# EasyEDA Pro project ProProject_H-Bridge_2024-06-21.epro

# Schematic finalna doska?
Create Date: 2024-05-27; Page Name: P1; Project Name: H-Bridge; Schematic Name: Schematic3; Update Date: 2024-05-27; Company: EasyEDA.com; Drawn: EasyEDA; Page Size: A4; Part Number: JLCPCB-002; Reviewed: EasyEDA; Version: V0.1
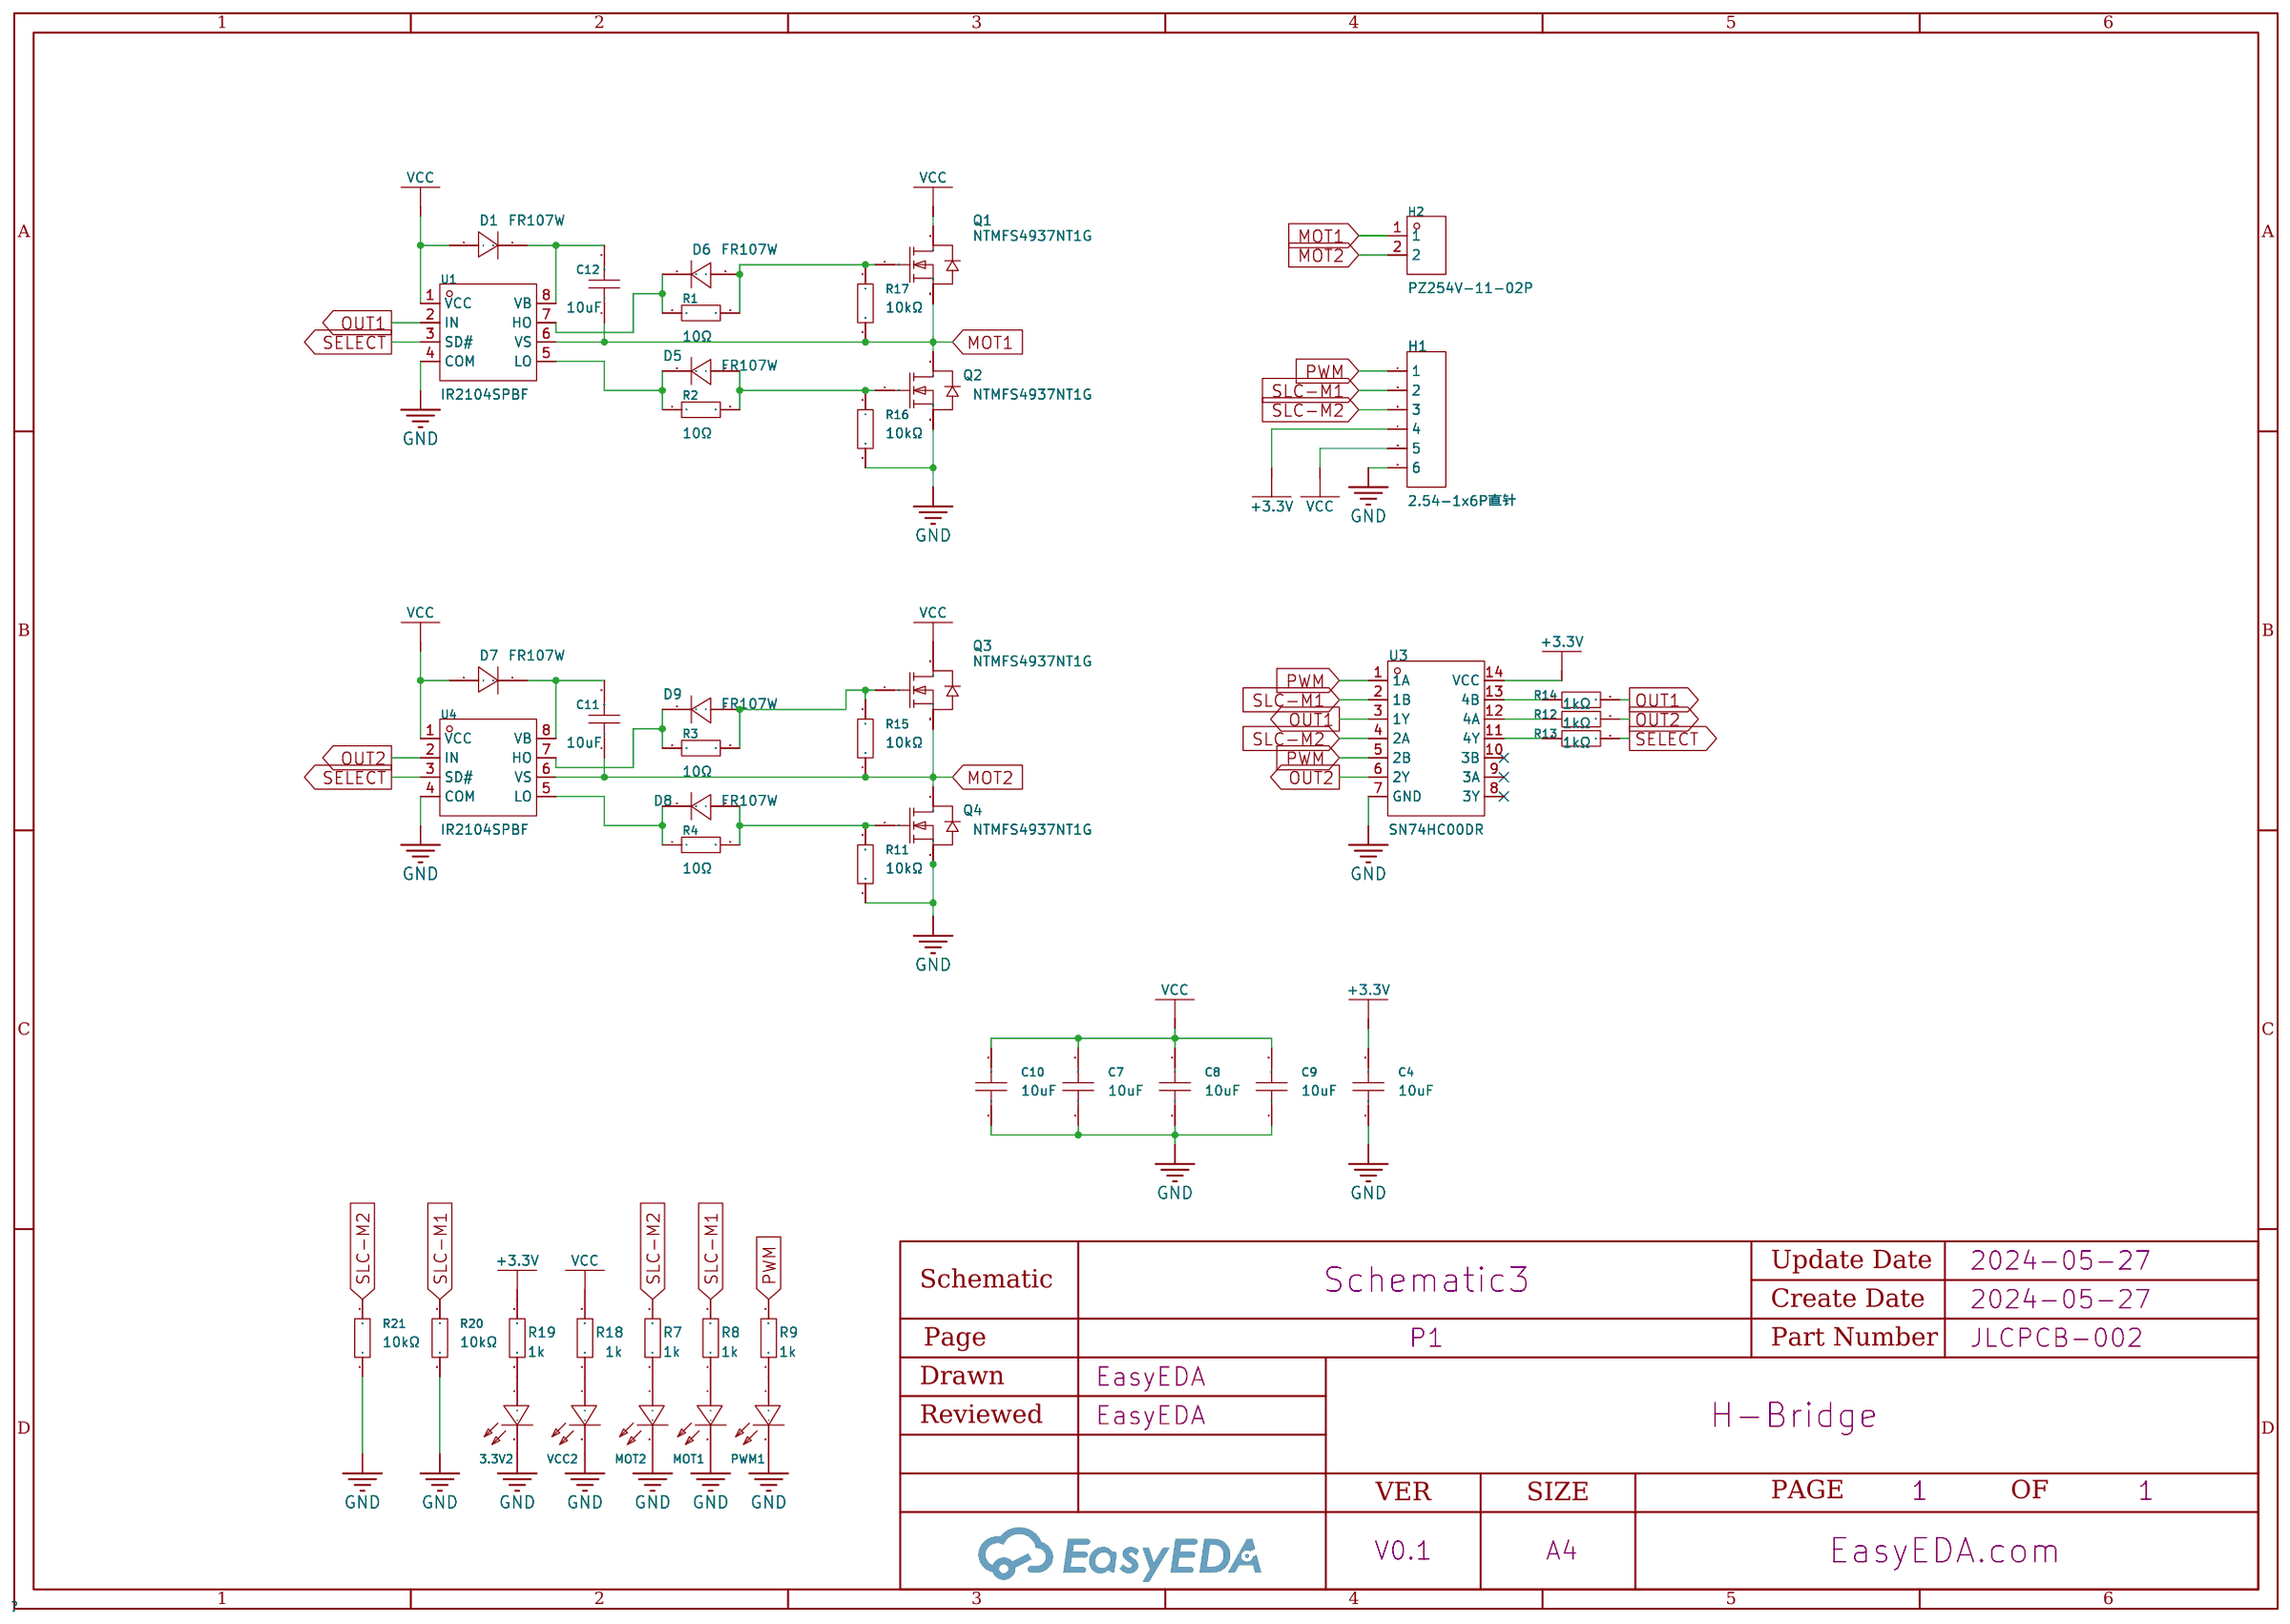
[diagram p0: schematic sheet]

## Parts
3.3V2  NCD0805R1  [LED0805-R-RD]
C4  10uF  [C1206]
C7  10uF  [C1206]
C8  10uF  [C1206]
C9  10uF  [C1206]
C10  10uF  [C1206]
C11  10uF  [C1206]
C12  10uF  [C1206]
D1  FR107W  [SOD-123F_L2.8-W1.8-LS3.7-RD]
D5  FR107W  [SOD-123F_L2.8-W1.8-LS3.7-RD]
D6  FR107W  [SOD-123F_L2.8-W1.8-LS3.7-RD]
D7  FR107W  [SOD-123F_L2.8-W1.8-LS3.7-RD]
D8  FR107W  [SOD-123F_L2.8-W1.8-LS3.7-RD]
D9  FR107W  [SOD-123F_L2.8-W1.8-LS3.7-RD]
H1  2.54-1x6P直针  [HDR-TH_6P-P2.54-V-M-1]
H2  PZ254V-11-02P  [HDR-TH_2P-P2.54-V-M]
MOT1  NCD0805R1  [LED0805-R-RD]
MOT2  NCD0805R1  [LED0805-R-RD]
PWM1  NCD0805R1  [LED0805-R-RD]
Q1  NTMFS4937NT1G  [DFN-5_L6.1-W5.1-P1.27-BL]
Q2  NTMFS4937NT1G  [DFN-5_L6.1-W5.1-P1.27-BL]
Q3  NTMFS4937NT1G  [DFN-5_L6.1-W5.1-P1.27-BL]
Q4  NTMFS4937NT1G  [DFN-5_L6.1-W5.1-P1.27-BL]
R1  10Ω  [R0805]
R2  10Ω  [R0805]
R3  10Ω  [R0805]
R4  10Ω  [R0805]
R7  1k  [R0603]
R8  1k  [R0603]
R9  1k  [R0603]
R11  10kΩ  [R0805]
R12  1kΩ  [R0805]
R13  1kΩ  [R0805]
R14  1kΩ  [R0805]
R15  10kΩ  [R0805]
R16  10kΩ  [R0805]
R17  10kΩ  [R0805]
R18  1k  [R0603]
R19  1k  [R0603]
R20  10kΩ  [R0805]
R21  10kΩ  [R0805]
U1  IR2104SPBF  [SOIC-8_L4.9-W3.9-P1.27-LS6.0-BL]
U3  SN74HC00DR  [SOIC-14_L8.7-W3.9-P1.27-LS6.0-BL]
U4  IR2104SPBF  [SOIC-8_L4.9-W3.9-P1.27-LS6.0-BL]
VCC2  NCD0805R1  [LED0805-R-RD]

## Library data of the parts
3.3V2 MOT1 MOT2 PWM1 VCC2 = Led_SMD_0805: Lamp Holder Type:- Emitted Color:Red Forward Voltage (VF):1.6V~2.6V Forward Voltage (VF):1.6V~2.6V Power Dissipation:65mW Forward Current:20mA Dominant Wavelength:615nm~630nm Dominant Wavelength:615nm~630nm Peak Wavelength:- Diode Configuration:独立二极管 Lens; Supplier Part: C84256; Manufacturer: 国星光电; Supplier Footprint: 0805; JLCPCB Part Class: Basic Part; Datasheet: https://atta.szlcsc.com/upload/public/pdf/source/20200820/C84256_F0A75A43B3EAD75808600A0514C76B99.pdf; Supplier: LCSC; Emitted Color: Red; Forward Voltage (VF): 1.6V~2.6V; Power Dissipation: 65mW; Forward Current: 20mA; Dominant Wavelength: 615nm~630nm; Diode Configuration: 独立二极管; Lens Color: 无色透明; Luminous Intensity: 67mcd~195mcd; Viewing Angle: 130°; Operating Temperature: -30℃~+85℃
C4 C7-C12 = CL31B106KAHNNNE: Capacitance: Tolerance:±10% Tolerance:±10% Voltage Rated: Temperature Coefficient:; LCSC Part Name: 10uF ±10% 25V; Supplier Part: C14860; Manufacturer: SAMSUNG(三星); Supplier Footprint: 1206; JLCPCB Part Class: Extended Part; Datasheet: https://atta.szlcsc.com/upload/public/pdf/source/20160218/1457707763339.pdf; Supplier: LCSC; Tolerance: ±10%
D1 D5-D9 = FR107W_C122857: Diode Configuration: Forward Voltage (Vf@If):1.3V@1A Reverse Voltage (Vr): Average Rectified Current (Io): Reverse Leakage Current:5uA@1kV Reverse Recovery Time (trr): Operating Temperature:-55℃~+150℃@(Tj) Operating Temperature:-55℃~+150℃@(Tj); LCSC Part Name: 电压:1kV 电流:1A; Supplier Part: C122857; Manufacturer: SHIKUES(时科); Supplier Footprint: SOD-123F; JLCPCB Part Class: Extended Part; Datasheet: https://atta.szlcsc.com/upload/public/pdf/source/20180316/F3E7108A5E6E8028984F3C9596186C34.pdf; Supplier: LCSC; Forward Voltage (Vf@If): 1.3V@1A; Reverse Leakage Current: 5uA@1kV; Operating Temperature: -55℃~+150℃@(Tj)
H1 = 2.54-1x6P直针: Pin Structure:1x6P Pitch:2.54mm Row Spacing:- Circluar Pins/Square Pins:Square Pins Mounting Type:Straight Number of Rows:Plugin Number of Pins:6P Current Rating (Max):3A Voltage Rating (Max):- Length of Mating Pin:- Insulation Height:- Contact Material:; LCSC Part Name: 间距:2.54mm 1x6P 直插 方针; Supplier Part: C37208; Manufacturer: BOOMELE(博穆精密); Supplier Footprint: 插件,P=2.54mm; JLCPCB Part Class: Extended Part; Supplier: LCSC; Pin Structure: 1x6P; Pitch: 2.54mm; Circluar Pins/Square Pins: Square Pins; Mounting Type: Straight; Number of Rows: Plugin; Number of Pins: 6P; Current Rating (Max): 3A; Operating Temperature Range: -40℃~+105℃; Color: Black
H2 = PZ254V-11-02P: Pin Structure:1x2P Pitch:2.54mm Row Spacing:- Circluar Pins/Square Pins:Square Pins Mounting Type:Straight Number of Rows:Plugin Number of Pins:2P Current Rating (Max):- Voltage Rating (Max):- Length of Mating Pin:6mm Insulation Height:2.5mm Length of End; LCSC Part Name: 间距:2.54mm 1x2P 直插 方针; Supplier Part: C492401; Manufacturer: XFCN(兴飞); Supplier Footprint: 插件,P=2.54mm; JLCPCB Part Class: Extended Part; Datasheet: https://atta.szlcsc.com/upload/public/pdf/source/20200309/C492401_A812433581A9B211A7FFA413ADDFF0E5.pdf; Supplier: LCSC; Pin Structure: 1x2P; Pitch: 2.54mm; Circluar Pins/Square Pins: Square Pins; Mounting Type: Straight; Number of Rows: Plugin; Number of Pins: 2P; Length of Mating Pin: 6mm; Insulation Height: 2.5mm; Length of End Connection Pin: 3mm; Operating Temperature Range: -40℃~+105℃; Color: Black
Q1-Q4 = NTMFS4937NT1G: Type:1个NChannel Drain Source Voltage (Vdss): Continuous Drain Current (Id):； Power Dissipation (Pd):； Drain Source On Resistance (RDS(on)@Vgs,Id):4mΩ@10V,30A Gate Threshold Voltage (Vgs(th)@Id):2.2V@250uA Total Gate Charge (Qg@Vgs):31nC@10V Input Capacita; LCSC Part Name: 1个N沟道 耐压:30V 电流:10.2A 电流:70A; Supplier Part: C94419; Manufacturer: onsemi(安森美); Supplier Footprint: DFN-5(5x6); JLCPCB Part Class: Extended Part; Datasheet: https://atta.szlcsc.com/upload/public/pdf/source/20170120/1484891320893.PDF; Supplier: LCSC; Type: 1个NChannel; Continuous Drain Current (Id): ；; Power Dissipation (Pd): ；; Drain Source On Resistance (RDS(on)@Vgs,Id): 4mΩ@10V,30A; Gate Threshold Voltage (Vgs(th)@Id): 2.2V@250uA; Total Gate Charge (Qg@Vgs): 31nC@10V; Input Capacitance (Ciss@Vds): 2.516nF@15V; Operating Temperature: -55℃~+150℃@(Tj)
R1-R4 R11-R17 R20 R21 = 0805W8F1002T5E: Type:Thick Film Resistors Resistance:10kΩ Tolerance:±1% Tolerance:±1% Power(Watts): Overload Voltage (Max): Temperature Coefficient:±100ppm/℃ Temperature Coefficient:±100ppm/℃ Operating Temperature Range:-55℃~+155℃ Operating Temperature Range:-55℃~+155℃; LCSC Part Name: 10kΩ ±1% 125mW 厚膜电阻; Supplier Part: C17414; Manufacturer: UNI-ROYAL(厚声); Supplier Footprint: 0805; JLCPCB Part Class: Basic Part; Datasheet: https://atta.szlcsc.com/upload/public/pdf/source/20200306/C422600_1E6D84923E4A46A82E41ADD87F860B5C.pdf; Supplier: LCSC; Type: Thick Film Resistors; Tolerance: ±1%; Temperature Coefficient: ±100ppm/℃; Operating Temperature Range: -55℃~+155℃
R7-R9 R18 R19 = Res_0603: Supplier Footprint: 0603
U1 U4 = IR2104SPBF_C5204801: Supplier Part: C5204801; Manufacturer: Infineon(英飞凌); Supplier Footprint: SOIC-8; JLCPCB Part Class: Extended Part; Datasheet: https://atta.szlcsc.com/upload/public/pdf/source/20200311/C495814_C460DC56A6CDB79957663740A058A097.pdf; Supplier: LCSC
U3 = SN74HC00DR: Logic Gate Type:与Non-门 Number of Channels:4 Supply Voltage:2V~6V Supply Voltage:2V~6V Quiescent Current (Max):2uA Sink Current:5.2mA Source Current:5.2mA High Level Range (VIH):1.5V~4.2V High Level Range (VIH):1.5V~4.2V Low Level Range (VIL):500mV~1.8V Lo; Supplier Part: C10090; Manufacturer: TI(德州仪器); Supplier Footprint: SOIC-14; JLCPCB Part Class: Extended Part; Datasheet: https://www.ti.com/cn/lit/gpn/sn74hc00; Supplier: LCSC; Logic Gate Type: 与Non-门; Number of Channels: 4; Supply Voltage: 2V~6V; Quiescent Current (Max): 2uA; Sink Current: 5.2mA; Source Current: 5.2mA; High Level Range (VIH): 1.5V~4.2V; Low Level Range (VIL): 500mV~1.8V; Series: 74HCSeries; Propagation Delay Time: 15ns@6V,50pF; Operating Temperature: -40℃~+85℃

## Nets
+3.3V: C4.2 H1.4 R19.2 U3.14(VCC)
GND: 3.3V2.2(-) C4.1 C7.1 C8.1 C9.1 C10.1 H1.6 MOT1.2(-) MOT2.2(-) PWM1.2(-) Q2.1(S) Q2.2(S) Q2.3(S) Q4.1(S) Q4.2(S) Q4.3(S) R11.1 R16.2 R20.1 R21.1 U1.4(COM) U3.7(GND) U4.4(COM) VCC2.2(-)
VCC: C7.2 C8.2 C9.2 C10.2 D1.2(A) D7.2(A) H1.5 Q1.5(D) Q3.5(D) R18.2 U1.1(VCC) U4.1(VCC)
MOT1: C12.1 H2.1 Q1.1(S) Q1.2(S) Q1.3(S) Q2.5(D) R17.2 U1.6(VS)
MOT2: C11.1 H2.2 Q3.1(S) Q3.2(S) Q3.3(S) Q4.5(D) R15.1 U4.6(VS)
OUT1: R14.2 U1.2(IN) U3.3(1Y)
OUT2: R12.2 U3.6(2Y) U4.2(IN)
PWM: H1.1 R9.2 U3.1(1A) U3.5(2B)
SELECT: R13.2 U1.3(SD#) U4.3(SD#)
SLC-M1: H1.2 R8.2 R20.2 U3.2(1B)
SLC-M2: H1.3 R7.2 R21.2 U3.4(2A)
Net-(3.3V2-1): 3.3V2.1(+) R19.1
Net-(C11-2): C11.2 D7.1(K) U4.8(VB)
Net-(C12-2): C12.2 D1.1(K) U1.8(VB)
Net-(D5-1): D5.1(K) R2.1 U1.5(LO)
Net-(D5-2): D5.2(A) Q2.4(G) R2.2 R16.1
Net-(D6-1): D6.1(K) R1.1 U1.7(HO)
Net-(D6-2): D6.2(A) Q1.4(G) R1.2 R17.1
Net-(D8-1): D8.1(K) R4.1 U4.5(LO)
Net-(D8-2): D8.2(A) Q4.4(G) R4.2 R11.2
Net-(D9-1): D9.1(K) R3.1 U4.7(HO)
Net-(D9-2): D9.2(A) Q3.4(G) R3.2 R15.2
Net-(MOT1-1): MOT1.1(+) R8.1
Net-(MOT2-1): MOT2.1(+) R7.1
Net-(PWM1-1): PWM1.1(+) R9.1
Net-(R12-1): R12.1 U3.12(4A)
Net-(R13-1): R13.1 U3.11(4Y)
Net-(R14-1): R14.1 U3.13(4B)
Net-(R18-1): R18.1 VCC2.1(+)

Not connected (* = marked no-connect by the designer): U3 8(3Y)* 9(3A)* 10(3B)*

# Schematic Schematic1
Create Date: 2024-04-17; Page Name: P1; Project Name: H-Bridge; Schematic Name: Schematic1; Update Date: 2024-04-25; Company: EasyEDA.com; Drawn: EasyEDA; Page Size: A4; Part Number: JLCPCB-002; Reviewed: EasyEDA; Version: V0.1
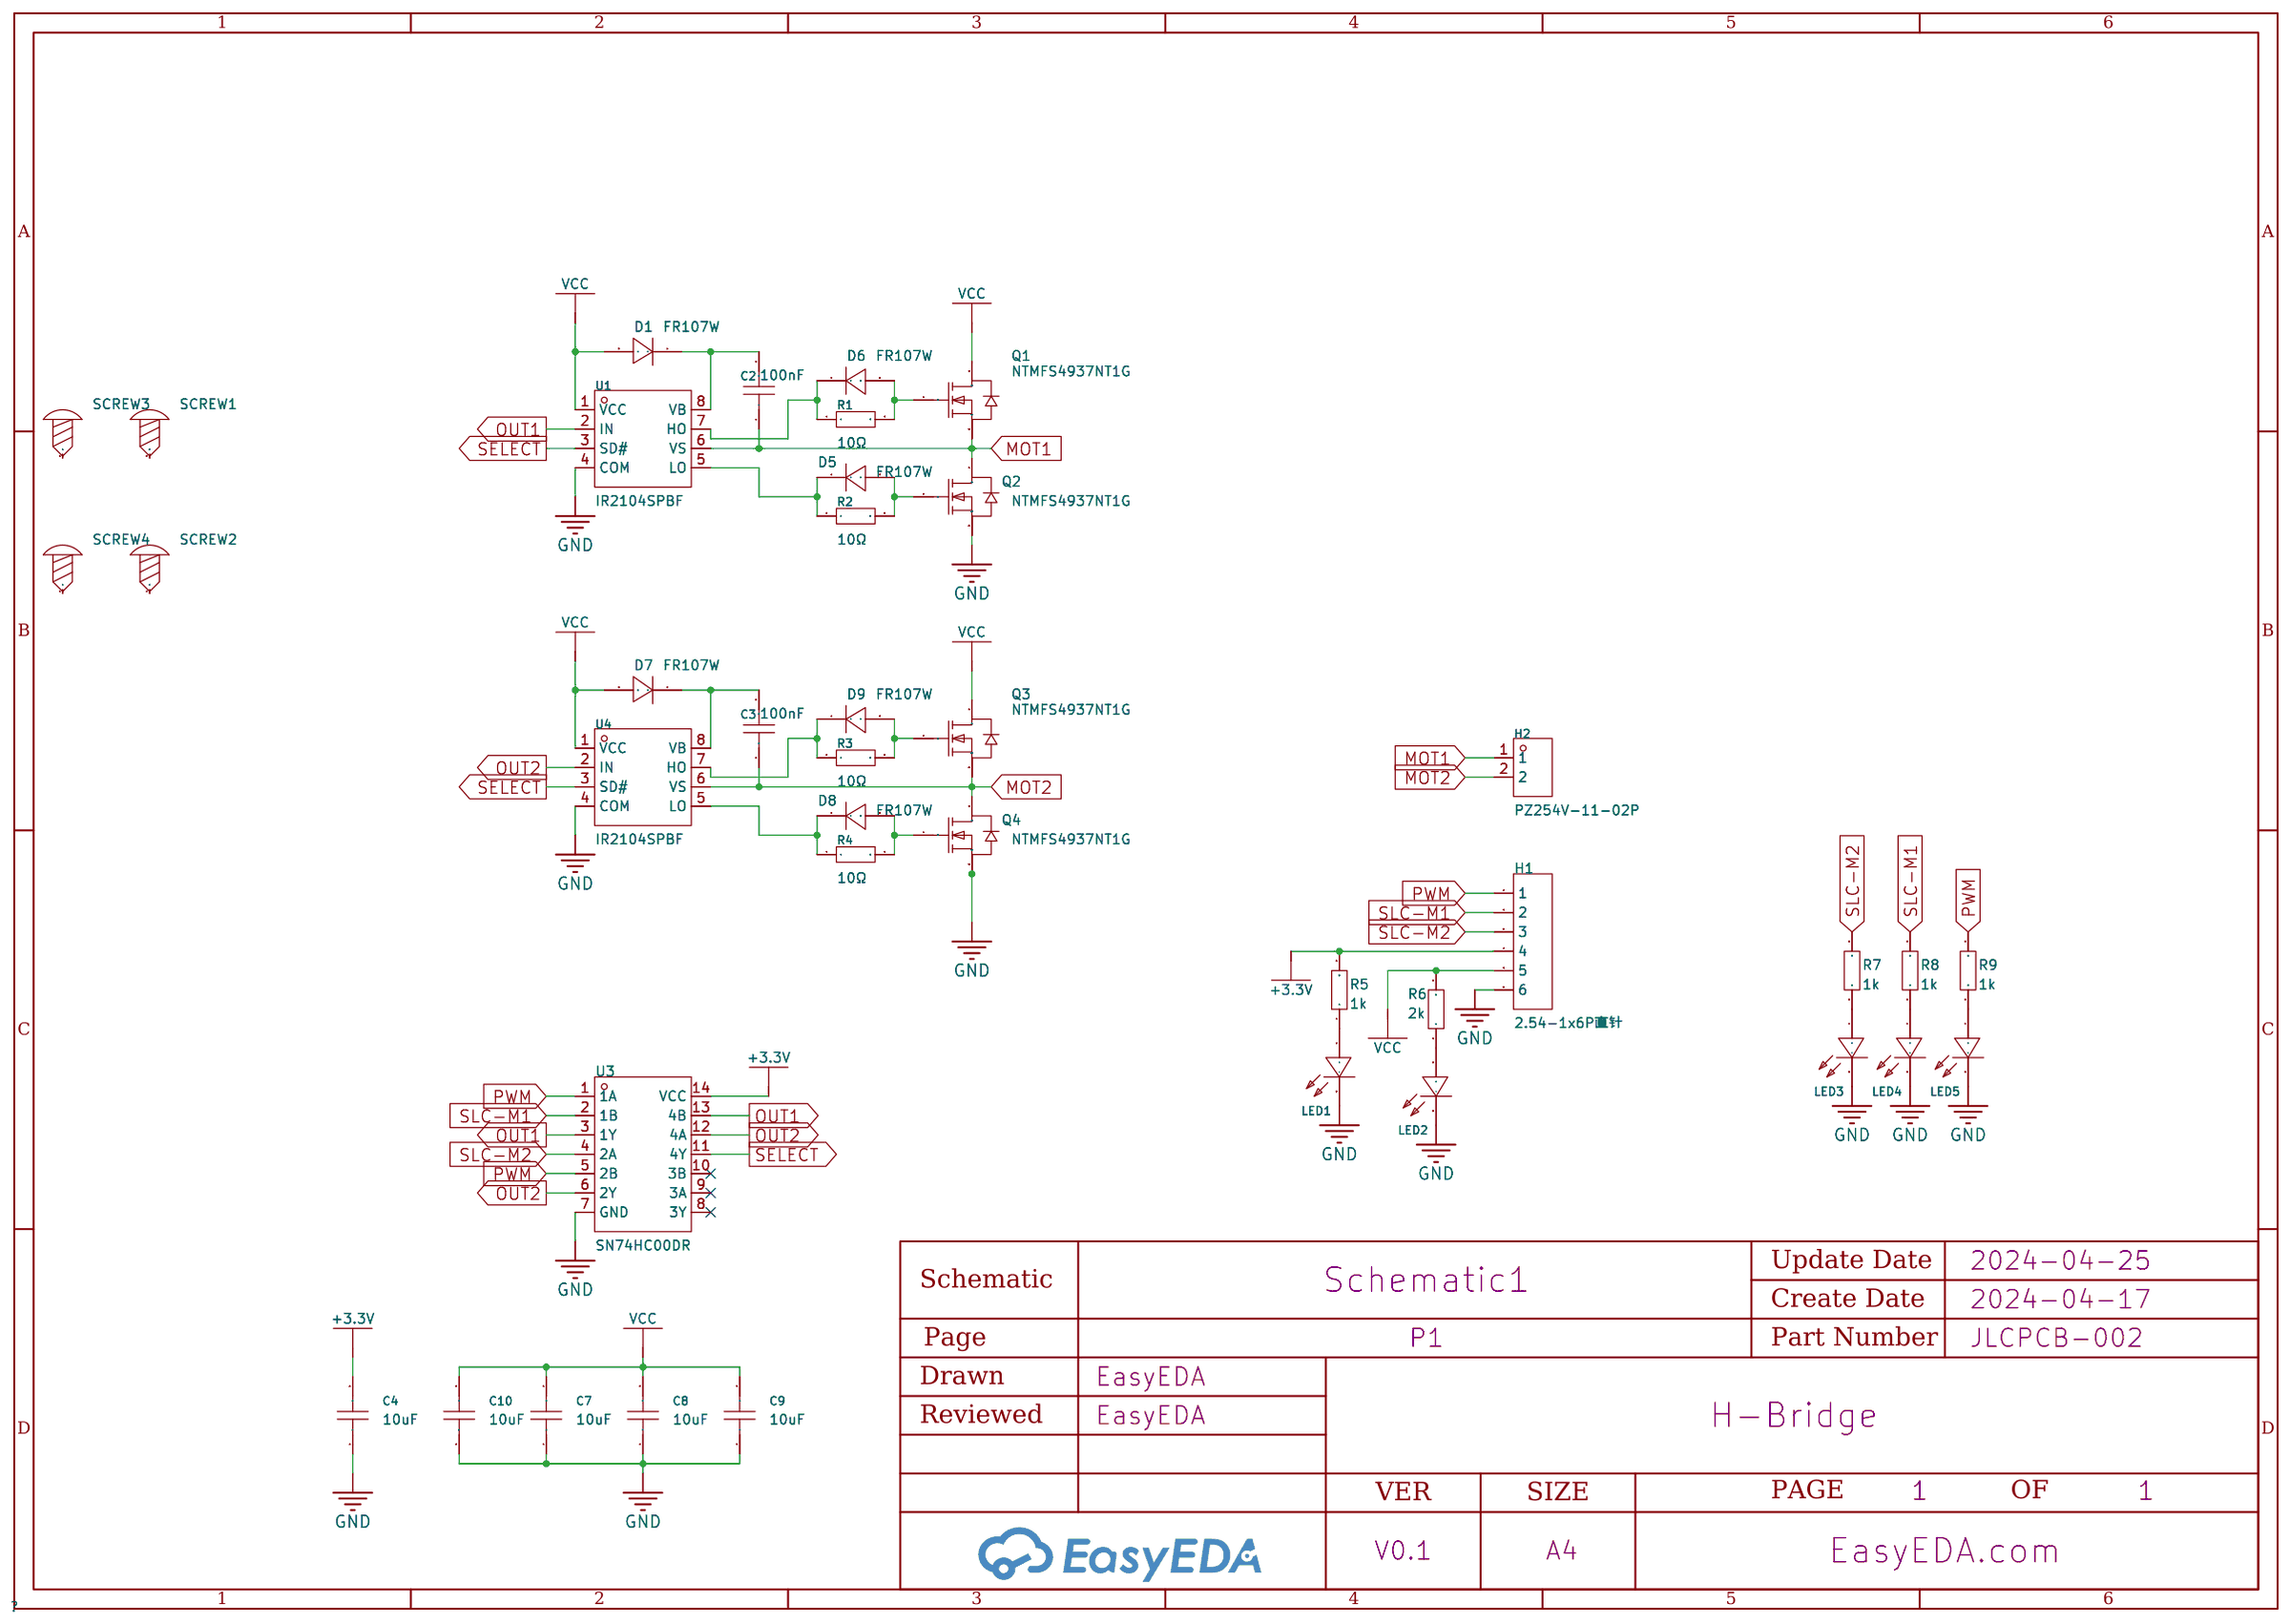
[diagram p1: schematic sheet]

## Parts
C2  100nF  [CAP-TH_L5.0-W2.5-P5.08-D0.7]
C3  100nF  [CAP-TH_L5.0-W2.5-P5.08-D0.7]
C4  10uF  [C1206]
C7  10uF  [C1206]
C8  10uF  [C1206]
C9  10uF  [C1206]
C10  10uF  [C1206]
D1  FR107W  [SOD-123F_L2.8-W1.8-LS3.7-RD]
D5  FR107W  [SOD-123F_L2.8-W1.8-LS3.7-RD]
D6  FR107W  [SOD-123F_L2.8-W1.8-LS3.7-RD]
D7  FR107W  [SOD-123F_L2.8-W1.8-LS3.7-RD]
D8  FR107W  [SOD-123F_L2.8-W1.8-LS3.7-RD]
D9  FR107W  [SOD-123F_L2.8-W1.8-LS3.7-RD]
H1  2.54-1x6P直针  [HDR-TH_6P-P2.54-V-M-1]
H2  PZ254V-11-02P  [HDR-TH_2P-P2.54-V-M]
LED1  NCD0805R1  [LED0805-R-RD]
LED2  NCD0805R1  [LED0805-R-RD]
LED3  NCD0805R1  [LED0805-R-RD]
LED4  NCD0805R1  [LED0805-R-RD]
LED5  NCD0805R1  [LED0805-R-RD]
Q1  NTMFS4937NT1G  [DFN-5_L6.1-W5.1-P1.27-BL]
Q2  NTMFS4937NT1G  [DFN-5_L6.1-W5.1-P1.27-BL]
Q3  NTMFS4937NT1G  [DFN-5_L6.1-W5.1-P1.27-BL]
Q4  NTMFS4937NT1G  [DFN-5_L6.1-W5.1-P1.27-BL]
R1  10Ω  [R0805]
R2  10Ω  [R0805]
R3  10Ω  [R0805]
R4  10Ω  [R0805]
R5  1k  [R0603]
R6  2k  [R0603]
R7  1k  [R0603]
R8  1k  [R0603]
R9  1k  [R0603]
SCREW1  -  [Screw-Hole-M2]
SCREW2  -  [Screw-Hole-M2]
SCREW3  -  [Screw-Hole-M2]
SCREW4  -  [Screw-Hole-M2]
U1  IR2104SPBF  [SOIC-8_L4.9-W3.9-P1.27-LS6.0-BL]
U3  SN74HC00DR  [SOIC-14_L8.7-W3.9-P1.27-LS6.0-BL]
U4  IR2104SPBF  [SOIC-8_L4.9-W3.9-P1.27-LS6.0-BL]

## Library data of the parts
C2 C3 = CC1H104ZC74D3F5O30MN: Capacitance:100nF Tolerance:-20%~+80% Tolerance:-20%~+80% Voltage Rated: Lead Spacing: Temperature Coefficient: φD: Body Thickness:; LCSC Part Name: 100nF -20%~+80% 50V; Supplier Part: C254094; Manufacturer: Dersonic(德尔创); Supplier Footprint: 插件,P=5.08mm; JLCPCB Part Class: Extended Part; Datasheet: https://atta.szlcsc.com/upload/public/pdf/source/20200826/C254094_5CB2628DB82B55380EF0EA1FCCF0C073.pdf; Supplier: LCSC; Tolerance: -20%~+80%
C4 C7-C10 = CL31B106KAHNNNE: Capacitance: Tolerance:±10% Tolerance:±10% Voltage Rated: Temperature Coefficient:; LCSC Part Name: 10uF ±10% 25V; Supplier Part: C14860; Manufacturer: SAMSUNG(三星); Supplier Footprint: 1206; JLCPCB Part Class: Extended Part; Datasheet: https://atta.szlcsc.com/upload/public/pdf/source/20160218/1457707763339.pdf; Supplier: LCSC; Tolerance: ±10%
D1 D5-D9 = FR107W_C122857: Diode Configuration: Forward Voltage (Vf@If):1.3V@1A Reverse Voltage (Vr): Average Rectified Current (Io): Reverse Leakage Current:5uA@1kV Reverse Recovery Time (trr): Operating Temperature:-55℃~+150℃@(Tj) Operating Temperature:-55℃~+150℃@(Tj); LCSC Part Name: 电压:1kV 电流:1A; Supplier Part: C122857; Manufacturer: SHIKUES(时科); Supplier Footprint: SOD-123F; JLCPCB Part Class: Extended Part; Datasheet: https://atta.szlcsc.com/upload/public/pdf/source/20180316/F3E7108A5E6E8028984F3C9596186C34.pdf; Supplier: LCSC; Forward Voltage (Vf@If): 1.3V@1A; Reverse Leakage Current: 5uA@1kV; Operating Temperature: -55℃~+150℃@(Tj)
H1 = 2.54-1x6P直针: Pin Structure:1x6P Pitch:2.54mm Row Spacing:- Circluar Pins/Square Pins:Square Pins Mounting Type:Straight Number of Rows:Plugin Number of Pins:6P Current Rating (Max):3A Voltage Rating (Max):- Length of Mating Pin:- Insulation Height:- Contact Material:; LCSC Part Name: 间距:2.54mm 1x6P 直插 方针; Supplier Part: C37208; Manufacturer: BOOMELE(博穆精密); Supplier Footprint: 插件,P=2.54mm; JLCPCB Part Class: Extended Part; Supplier: LCSC; Pin Structure: 1x6P; Pitch: 2.54mm; Circluar Pins/Square Pins: Square Pins; Mounting Type: Straight; Number of Rows: Plugin; Number of Pins: 6P; Current Rating (Max): 3A; Operating Temperature Range: -40℃~+105℃; Color: Black
H2 = PZ254V-11-02P: Pin Structure:1x2P Pitch:2.54mm Row Spacing:- Circluar Pins/Square Pins:Square Pins Mounting Type:Straight Number of Rows:Plugin Number of Pins:2P Current Rating (Max):- Voltage Rating (Max):- Length of Mating Pin:6mm Insulation Height:2.5mm Length of End; LCSC Part Name: 间距:2.54mm 1x2P 直插 方针; Supplier Part: C492401; Manufacturer: XFCN(兴飞); Supplier Footprint: 插件,P=2.54mm; JLCPCB Part Class: Extended Part; Datasheet: https://atta.szlcsc.com/upload/public/pdf/source/20200309/C492401_A812433581A9B211A7FFA413ADDFF0E5.pdf; Supplier: LCSC; Pin Structure: 1x2P; Pitch: 2.54mm; Circluar Pins/Square Pins: Square Pins; Mounting Type: Straight; Number of Rows: Plugin; Number of Pins: 2P; Length of Mating Pin: 6mm; Insulation Height: 2.5mm; Length of End Connection Pin: 3mm; Operating Temperature Range: -40℃~+105℃; Color: Black
LED1-LED5 = Led_SMD_0805: Lamp Holder Type:- Emitted Color:Red Forward Voltage (VF):1.6V~2.6V Forward Voltage (VF):1.6V~2.6V Power Dissipation:65mW Forward Current:20mA Dominant Wavelength:615nm~630nm Dominant Wavelength:615nm~630nm Peak Wavelength:- Diode Configuration:独立二极管 Lens; Supplier Part: C84256; Manufacturer: 国星光电; Supplier Footprint: 0805; JLCPCB Part Class: Basic Part; Datasheet: https://atta.szlcsc.com/upload/public/pdf/source/20200820/C84256_F0A75A43B3EAD75808600A0514C76B99.pdf; Supplier: LCSC; Emitted Color: Red; Forward Voltage (VF): 1.6V~2.6V; Power Dissipation: 65mW; Forward Current: 20mA; Dominant Wavelength: 615nm~630nm; Diode Configuration: 独立二极管; Lens Color: 无色透明; Luminous Intensity: 67mcd~195mcd; Viewing Angle: 130°; Operating Temperature: -30℃~+85℃
Q1-Q4 = NTMFS4937NT1G: Type:1个NChannel Drain Source Voltage (Vdss): Continuous Drain Current (Id):； Power Dissipation (Pd):； Drain Source On Resistance (RDS(on)@Vgs,Id):4mΩ@10V,30A Gate Threshold Voltage (Vgs(th)@Id):2.2V@250uA Total Gate Charge (Qg@Vgs):31nC@10V Input Capacita; LCSC Part Name: 1个N沟道 耐压:30V 电流:10.2A 电流:70A; Supplier Part: C94419; Manufacturer: onsemi(安森美); Supplier Footprint: DFN-5(5x6); JLCPCB Part Class: Extended Part; Datasheet: https://atta.szlcsc.com/upload/public/pdf/source/20170120/1484891320893.PDF; Supplier: LCSC; Type: 1个NChannel; Continuous Drain Current (Id): ；; Power Dissipation (Pd): ；; Drain Source On Resistance (RDS(on)@Vgs,Id): 4mΩ@10V,30A; Gate Threshold Voltage (Vgs(th)@Id): 2.2V@250uA; Total Gate Charge (Qg@Vgs): 31nC@10V; Input Capacitance (Ciss@Vds): 2.516nF@15V; Operating Temperature: -55℃~+150℃@(Tj)
R1-R4 = 0805W8F1002T5E: Type:Thick Film Resistors Resistance:10kΩ Tolerance:±1% Tolerance:±1% Power(Watts): Overload Voltage (Max): Temperature Coefficient:±100ppm/℃ Temperature Coefficient:±100ppm/℃ Operating Temperature Range:-55℃~+155℃ Operating Temperature Range:-55℃~+155℃; LCSC Part Name: 10kΩ ±1% 125mW 厚膜电阻; Supplier Part: C17414; Manufacturer: UNI-ROYAL(厚声); Supplier Footprint: 0805; JLCPCB Part Class: Basic Part; Datasheet: https://atta.szlcsc.com/upload/public/pdf/source/20200306/C422600_1E6D84923E4A46A82E41ADD87F860B5C.pdf; Supplier: LCSC; Type: Thick Film Resistors; Tolerance: ±1%; Temperature Coefficient: ±100ppm/℃; Operating Temperature Range: -55℃~+155℃
R5-R9 = Res_0603: Supplier Footprint: 0603
SCREW1-SCREW4 = Screw-Hole-M2: Supplier Footprint: 插件
U1 U4 = IR2104SPBF_C5204801: Supplier Part: C5204801; Manufacturer: Infineon(英飞凌); Supplier Footprint: SOIC-8; JLCPCB Part Class: Extended Part; Datasheet: https://atta.szlcsc.com/upload/public/pdf/source/20200311/C495814_C460DC56A6CDB79957663740A058A097.pdf; Supplier: LCSC
U3 = SN74HC00DR: Logic Gate Type:与Non-门 Number of Channels:4 Supply Voltage:2V~6V Supply Voltage:2V~6V Quiescent Current (Max):2uA Sink Current:5.2mA Source Current:5.2mA High Level Range (VIH):1.5V~4.2V High Level Range (VIH):1.5V~4.2V Low Level Range (VIL):500mV~1.8V Lo; Supplier Part: C10090; Manufacturer: TI(德州仪器); Supplier Footprint: SOIC-14; JLCPCB Part Class: Extended Part; Datasheet: https://www.ti.com/cn/lit/gpn/sn74hc00; Supplier: LCSC; Logic Gate Type: 与Non-门; Number of Channels: 4; Supply Voltage: 2V~6V; Quiescent Current (Max): 2uA; Sink Current: 5.2mA; Source Current: 5.2mA; High Level Range (VIH): 1.5V~4.2V; Low Level Range (VIL): 500mV~1.8V; Series: 74HCSeries; Propagation Delay Time: 15ns@6V,50pF; Operating Temperature: -40℃~+85℃

## Nets
+3.3V: C4.2 H1.4 R5.2 U3.14(VCC)
GND: C4.1 C7.1 C8.1 C9.1 C10.1 H1.6 LED1.2(-) LED2.2(-) LED3.2(-) LED4.2(-) LED5.2(-) Q2.1(S) Q2.2(S) Q2.3(S) Q4.1(S) Q4.2(S) Q4.3(S) U1.4(COM) U3.7(GND) U4.4(COM)
VCC: C7.2 C8.2 C9.2 C10.2 D1.2(A) D7.2(A) H1.5 Q1.5(D) Q3.5(D) R6.2 U1.1(VCC) U4.1(VCC)
MOT1: C2.1 H2.1 Q1.1(S) Q1.2(S) Q1.3(S) Q2.5(D) U1.6(VS)
MOT2: C3.1 H2.2 Q3.1(S) Q3.2(S) Q3.3(S) Q4.5(D) U4.6(VS)
OUT1: U1.2(IN) U3.3(1Y) U3.13(4B)
OUT2: U3.6(2Y) U3.12(4A) U4.2(IN)
PWM: H1.1 R9.2 U3.1(1A) U3.5(2B)
SELECT: U1.3(SD#) U3.11(4Y) U4.3(SD#)
SLC-M1: H1.2 R8.2 U3.2(1B)
SLC-M2: H1.3 R7.2 U3.4(2A)
$1N2563: D5.2(A) Q2.4(G) R2.2
$1N2573: D6.2(A) Q1.4(G) R1.2
$1N2580: C2.2 D1.1(K) U1.8(VB)
$1N2605: D5.1(K) R2.1 U1.5(LO)
$1N2712: D6.1(K) R1.1 U1.7(HO)
$1N3149: D8.2(A) Q4.4(G) R4.2
$1N3153: D9.2(A) Q3.4(G) R3.2
$1N3157: C3.2 D7.1(K) U4.8(VB)
$1N3161: D8.1(K) R4.1 U4.5(LO)
$1N3174: D9.1(K) R3.1 U4.7(HO)
$1N6041: LED1.1(+) R5.1
$1N6069: LED2.1(+) R6.1
$1N6194: LED3.1(+) R7.1
$1N6279: LED4.1(+) R8.1
$1N6364: LED5.1(+) R9.1

Not connected (* = marked no-connect by the designer): SCREW1 1; SCREW2 1; SCREW3 1; SCREW4 1; U3 8(3Y)* 9(3A)* 10(3B)*

# Schematic Schematic2
Create Date: 2024-04-25; Page Name: P1; Project Name: H-Bridge; Schematic Name: Schematic2; Update Date: 2024-04-25; Company: EasyEDA.com; Drawn: EasyEDA; Page Size: A4; Part Number: JLCPCB-002; Reviewed: EasyEDA; Version: V0.1
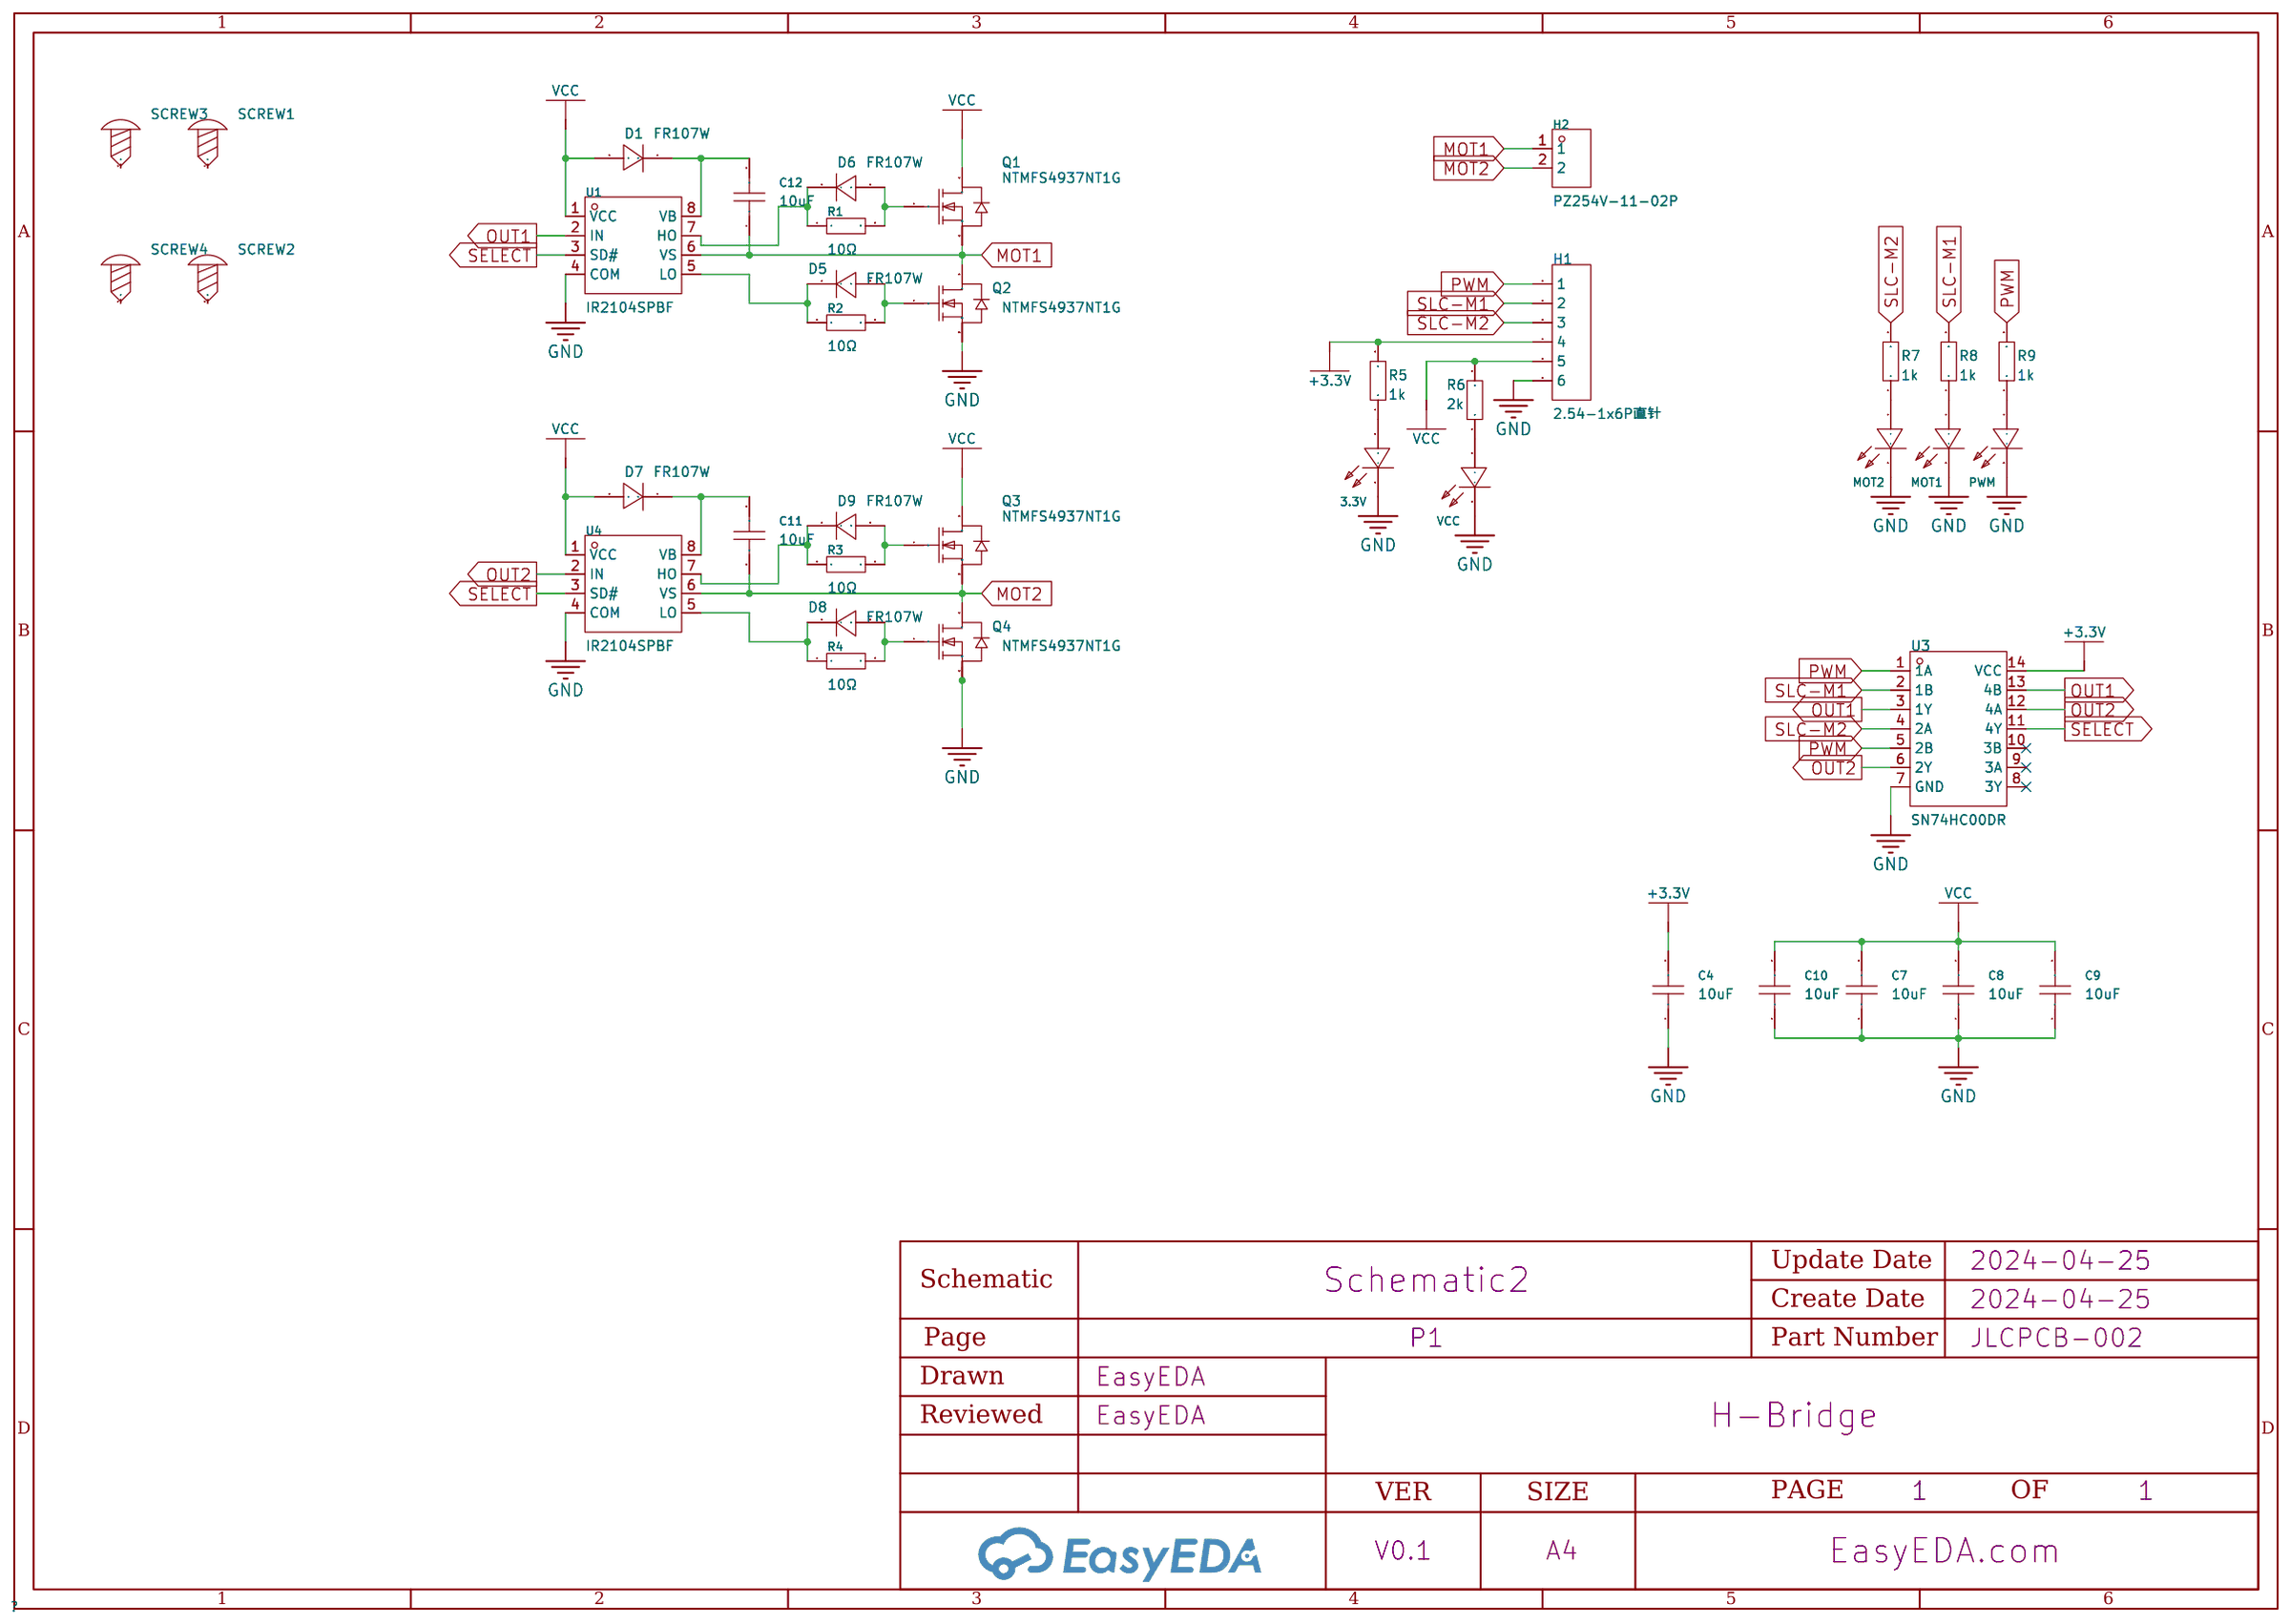
[diagram p2: schematic sheet]

## Parts
3.3V  NCD0805R1  [LED0805-R-RD]
C4  10uF  [C1206]
C7  10uF  [C1206]
C8  10uF  [C1206]
C9  10uF  [C1206]
C10  10uF  [C1206]
C11  10uF  [C1206]
C12  10uF  [C1206]
D1  FR107W  [SOD-123F_L2.8-W1.8-LS3.7-RD]
D5  FR107W  [SOD-123F_L2.8-W1.8-LS3.7-RD]
D6  FR107W  [SOD-123F_L2.8-W1.8-LS3.7-RD]
D7  FR107W  [SOD-123F_L2.8-W1.8-LS3.7-RD]
D8  FR107W  [SOD-123F_L2.8-W1.8-LS3.7-RD]
D9  FR107W  [SOD-123F_L2.8-W1.8-LS3.7-RD]
H1  2.54-1x6P直针  [HDR-TH_6P-P2.54-V-M-1]
H2  PZ254V-11-02P  [HDR-TH_2P-P2.54-V-M]
MOT1  NCD0805R1  [LED0805-R-RD]
MOT2  NCD0805R1  [LED0805-R-RD]
PWM  NCD0805R1  [LED0805-R-RD]
Q1  NTMFS4937NT1G  [DFN-5_L6.1-W5.1-P1.27-BL]
Q2  NTMFS4937NT1G  [DFN-5_L6.1-W5.1-P1.27-BL]
Q3  NTMFS4937NT1G  [DFN-5_L6.1-W5.1-P1.27-BL]
Q4  NTMFS4937NT1G  [DFN-5_L6.1-W5.1-P1.27-BL]
R1  10Ω  [R0805]
R2  10Ω  [R0805]
R3  10Ω  [R0805]
R4  10Ω  [R0805]
R5  1k  [R0603]
R6  2k  [R0603]
R7  1k  [R0603]
R8  1k  [R0603]
R9  1k  [R0603]
SCREW1  -  [Screw-Hole-M2]
SCREW2  -  [Screw-Hole-M2]
SCREW3  -  [Screw-Hole-M2]
SCREW4  -  [Screw-Hole-M2]
U1  IR2104SPBF  [SOIC-8_L4.9-W3.9-P1.27-LS6.0-BL]
U3  SN74HC00DR  [SOIC-14_L8.7-W3.9-P1.27-LS6.0-BL]
U4  IR2104SPBF  [SOIC-8_L4.9-W3.9-P1.27-LS6.0-BL]
VCC  NCD0805R1  [LED0805-R-RD]

## Library data of the parts
3.3V MOT1 MOT2 PWM VCC = Led_SMD_0805: Lamp Holder Type:- Emitted Color:Red Forward Voltage (VF):1.6V~2.6V Forward Voltage (VF):1.6V~2.6V Power Dissipation:65mW Forward Current:20mA Dominant Wavelength:615nm~630nm Dominant Wavelength:615nm~630nm Peak Wavelength:- Diode Configuration:独立二极管 Lens; Supplier Part: C84256; Manufacturer: 国星光电; Supplier Footprint: 0805; JLCPCB Part Class: Basic Part; Datasheet: https://atta.szlcsc.com/upload/public/pdf/source/20200820/C84256_F0A75A43B3EAD75808600A0514C76B99.pdf; Supplier: LCSC; Emitted Color: Red; Forward Voltage (VF): 1.6V~2.6V; Power Dissipation: 65mW; Forward Current: 20mA; Dominant Wavelength: 615nm~630nm; Diode Configuration: 独立二极管; Lens Color: 无色透明; Luminous Intensity: 67mcd~195mcd; Viewing Angle: 130°; Operating Temperature: -30℃~+85℃
C4 C7-C12 = CL31B106KAHNNNE: Capacitance: Tolerance:±10% Tolerance:±10% Voltage Rated: Temperature Coefficient:; LCSC Part Name: 10uF ±10% 25V; Supplier Part: C14860; Manufacturer: SAMSUNG(三星); Supplier Footprint: 1206; JLCPCB Part Class: Extended Part; Datasheet: https://atta.szlcsc.com/upload/public/pdf/source/20160218/1457707763339.pdf; Supplier: LCSC; Tolerance: ±10%
D1 D5-D9 = FR107W_C122857: Diode Configuration: Forward Voltage (Vf@If):1.3V@1A Reverse Voltage (Vr): Average Rectified Current (Io): Reverse Leakage Current:5uA@1kV Reverse Recovery Time (trr): Operating Temperature:-55℃~+150℃@(Tj) Operating Temperature:-55℃~+150℃@(Tj); LCSC Part Name: 电压:1kV 电流:1A; Supplier Part: C122857; Manufacturer: SHIKUES(时科); Supplier Footprint: SOD-123F; JLCPCB Part Class: Extended Part; Datasheet: https://atta.szlcsc.com/upload/public/pdf/source/20180316/F3E7108A5E6E8028984F3C9596186C34.pdf; Supplier: LCSC; Forward Voltage (Vf@If): 1.3V@1A; Reverse Leakage Current: 5uA@1kV; Operating Temperature: -55℃~+150℃@(Tj)
H1 = 2.54-1x6P直针: Pin Structure:1x6P Pitch:2.54mm Row Spacing:- Circluar Pins/Square Pins:Square Pins Mounting Type:Straight Number of Rows:Plugin Number of Pins:6P Current Rating (Max):3A Voltage Rating (Max):- Length of Mating Pin:- Insulation Height:- Contact Material:; LCSC Part Name: 间距:2.54mm 1x6P 直插 方针; Supplier Part: C37208; Manufacturer: BOOMELE(博穆精密); Supplier Footprint: 插件,P=2.54mm; JLCPCB Part Class: Extended Part; Supplier: LCSC; Pin Structure: 1x6P; Pitch: 2.54mm; Circluar Pins/Square Pins: Square Pins; Mounting Type: Straight; Number of Rows: Plugin; Number of Pins: 6P; Current Rating (Max): 3A; Operating Temperature Range: -40℃~+105℃; Color: Black
H2 = PZ254V-11-02P: Pin Structure:1x2P Pitch:2.54mm Row Spacing:- Circluar Pins/Square Pins:Square Pins Mounting Type:Straight Number of Rows:Plugin Number of Pins:2P Current Rating (Max):- Voltage Rating (Max):- Length of Mating Pin:6mm Insulation Height:2.5mm Length of End; LCSC Part Name: 间距:2.54mm 1x2P 直插 方针; Supplier Part: C492401; Manufacturer: XFCN(兴飞); Supplier Footprint: 插件,P=2.54mm; JLCPCB Part Class: Extended Part; Datasheet: https://atta.szlcsc.com/upload/public/pdf/source/20200309/C492401_A812433581A9B211A7FFA413ADDFF0E5.pdf; Supplier: LCSC; Pin Structure: 1x2P; Pitch: 2.54mm; Circluar Pins/Square Pins: Square Pins; Mounting Type: Straight; Number of Rows: Plugin; Number of Pins: 2P; Length of Mating Pin: 6mm; Insulation Height: 2.5mm; Length of End Connection Pin: 3mm; Operating Temperature Range: -40℃~+105℃; Color: Black
Q1-Q4 = NTMFS4937NT1G: Type:1个NChannel Drain Source Voltage (Vdss): Continuous Drain Current (Id):； Power Dissipation (Pd):； Drain Source On Resistance (RDS(on)@Vgs,Id):4mΩ@10V,30A Gate Threshold Voltage (Vgs(th)@Id):2.2V@250uA Total Gate Charge (Qg@Vgs):31nC@10V Input Capacita; LCSC Part Name: 1个N沟道 耐压:30V 电流:10.2A 电流:70A; Supplier Part: C94419; Manufacturer: onsemi(安森美); Supplier Footprint: DFN-5(5x6); JLCPCB Part Class: Extended Part; Datasheet: https://atta.szlcsc.com/upload/public/pdf/source/20170120/1484891320893.PDF; Supplier: LCSC; Type: 1个NChannel; Continuous Drain Current (Id): ；; Power Dissipation (Pd): ；; Drain Source On Resistance (RDS(on)@Vgs,Id): 4mΩ@10V,30A; Gate Threshold Voltage (Vgs(th)@Id): 2.2V@250uA; Total Gate Charge (Qg@Vgs): 31nC@10V; Input Capacitance (Ciss@Vds): 2.516nF@15V; Operating Temperature: -55℃~+150℃@(Tj)
R1-R4 = 0805W8F1002T5E: Type:Thick Film Resistors Resistance:10kΩ Tolerance:±1% Tolerance:±1% Power(Watts): Overload Voltage (Max): Temperature Coefficient:±100ppm/℃ Temperature Coefficient:±100ppm/℃ Operating Temperature Range:-55℃~+155℃ Operating Temperature Range:-55℃~+155℃; LCSC Part Name: 10kΩ ±1% 125mW 厚膜电阻; Supplier Part: C17414; Manufacturer: UNI-ROYAL(厚声); Supplier Footprint: 0805; JLCPCB Part Class: Basic Part; Datasheet: https://atta.szlcsc.com/upload/public/pdf/source/20200306/C422600_1E6D84923E4A46A82E41ADD87F860B5C.pdf; Supplier: LCSC; Type: Thick Film Resistors; Tolerance: ±1%; Temperature Coefficient: ±100ppm/℃; Operating Temperature Range: -55℃~+155℃
R5-R9 = Res_0603: Supplier Footprint: 0603
SCREW1-SCREW4 = Screw-Hole-M2: Supplier Footprint: 插件
U1 U4 = IR2104SPBF_C5204801: Supplier Part: C5204801; Manufacturer: Infineon(英飞凌); Supplier Footprint: SOIC-8; JLCPCB Part Class: Extended Part; Datasheet: https://atta.szlcsc.com/upload/public/pdf/source/20200311/C495814_C460DC56A6CDB79957663740A058A097.pdf; Supplier: LCSC
U3 = SN74HC00DR: Logic Gate Type:与Non-门 Number of Channels:4 Supply Voltage:2V~6V Supply Voltage:2V~6V Quiescent Current (Max):2uA Sink Current:5.2mA Source Current:5.2mA High Level Range (VIH):1.5V~4.2V High Level Range (VIH):1.5V~4.2V Low Level Range (VIL):500mV~1.8V Lo; Supplier Part: C10090; Manufacturer: TI(德州仪器); Supplier Footprint: SOIC-14; JLCPCB Part Class: Extended Part; Datasheet: https://www.ti.com/cn/lit/gpn/sn74hc00; Supplier: LCSC; Logic Gate Type: 与Non-门; Number of Channels: 4; Supply Voltage: 2V~6V; Quiescent Current (Max): 2uA; Sink Current: 5.2mA; Source Current: 5.2mA; High Level Range (VIH): 1.5V~4.2V; Low Level Range (VIL): 500mV~1.8V; Series: 74HCSeries; Propagation Delay Time: 15ns@6V,50pF; Operating Temperature: -40℃~+85℃

## Nets
+3.3V: C4.2 H1.4 R5.2 U3.14(VCC)
GND: 3.3V.2(-) C4.1 C7.1 C8.1 C9.1 C10.1 H1.6 MOT1.2(-) MOT2.2(-) PWM.2(-) Q2.1(S) Q2.2(S) Q2.3(S) Q4.1(S) Q4.2(S) Q4.3(S) U1.4(COM) U3.7(GND) U4.4(COM) VCC.2(-)
VCC: C7.2 C8.2 C9.2 C10.2 D1.2(A) D7.2(A) H1.5 Q1.5(D) Q3.5(D) R6.2 U1.1(VCC) U4.1(VCC)
MOT1: C12.1 H2.1 Q1.1(S) Q1.2(S) Q1.3(S) Q2.5(D) U1.6(VS)
MOT2: C11.1 H2.2 Q3.1(S) Q3.2(S) Q3.3(S) Q4.5(D) U4.6(VS)
OUT1: U1.2(IN) U3.3(1Y) U3.13(4B)
OUT2: U3.6(2Y) U3.12(4A) U4.2(IN)
PWM: H1.1 R9.2 U3.1(1A) U3.5(2B)
SELECT: U1.3(SD#) U3.11(4Y) U4.3(SD#)
SLC-M1: H1.2 R8.2 U3.2(1B)
SLC-M2: H1.3 R7.2 U3.4(2A)
$1N961: D5.2(A) Q2.4(G) R2.2
$1N962: D6.2(A) Q1.4(G) R1.2
$1N963: C12.2 D1.1(K) U1.8(VB)
$1N964: D5.1(K) R2.1 U1.5(LO)
$1N966: D6.1(K) R1.1 U1.7(HO)
$1N973: D8.2(A) Q4.4(G) R4.2
$1N974: D9.2(A) Q3.4(G) R3.2
$1N975: C11.2 D7.1(K) U4.8(VB)
$1N976: D8.1(K) R4.1 U4.5(LO)
$1N978: D9.1(K) R3.1 U4.7(HO)
$1N1617: 3.3V.1(+) R5.1
$1N1618: R6.1 VCC.1(+)
$1N1619: MOT2.1(+) R7.1
$1N1622: MOT1.1(+) R8.1
$1N1625: PWM.1(+) R9.1

Not connected (* = marked no-connect by the designer): SCREW1 1; SCREW2 1; SCREW3 1; SCREW4 1; U3 8(3Y)* 9(3A)* 10(3B)*

# Board PCB1
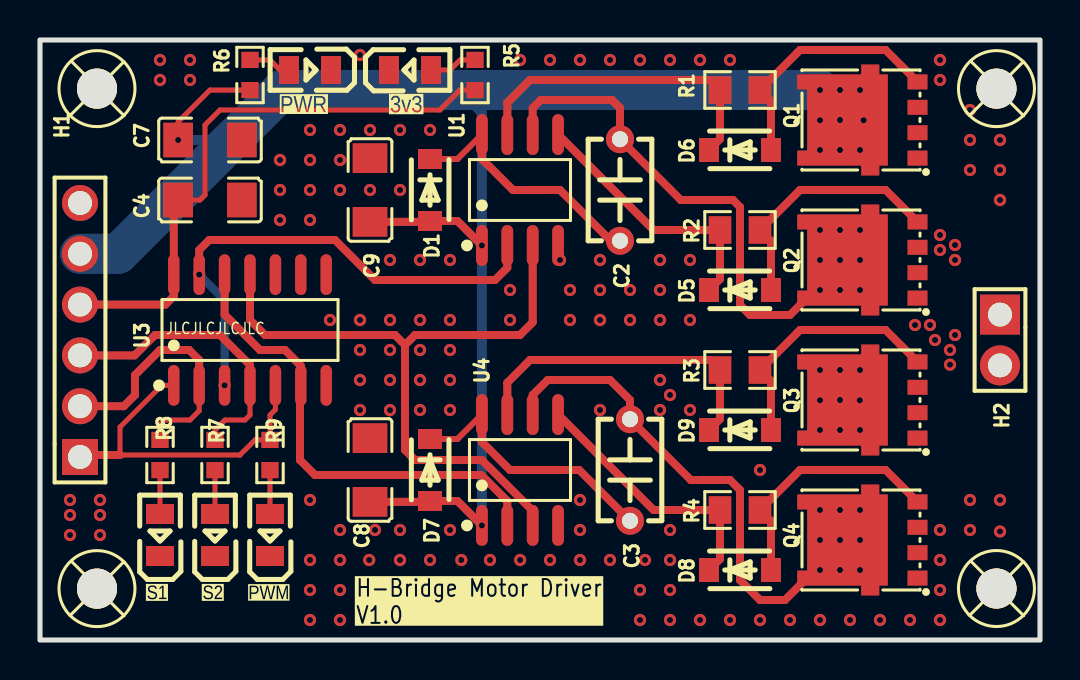
[diagram p3: board, top side]
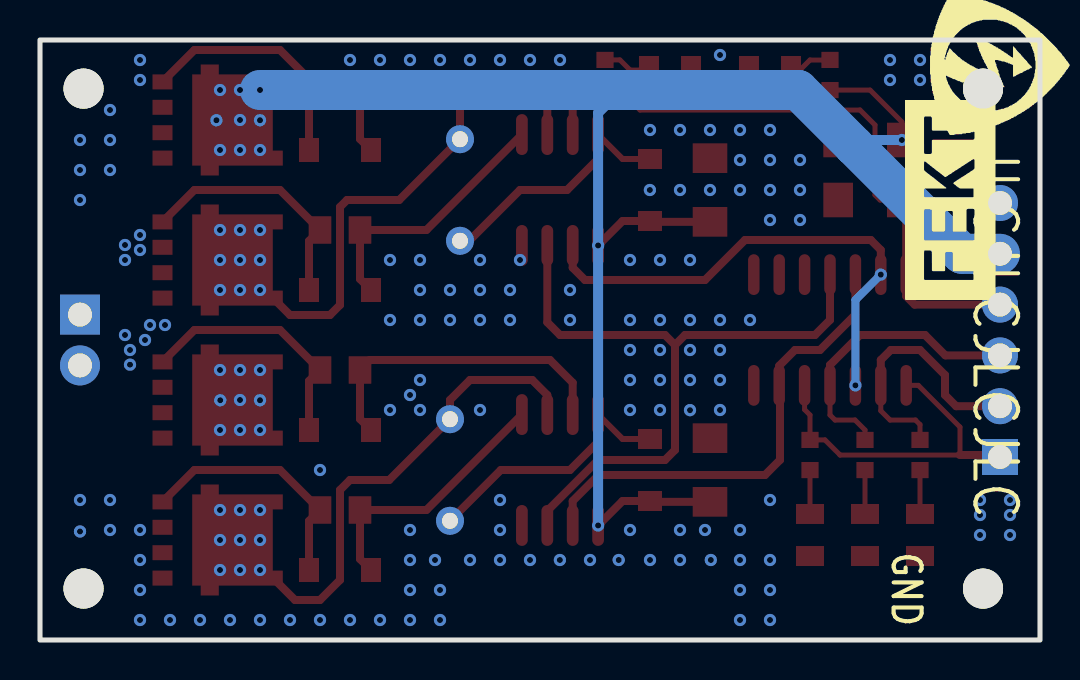
[diagram p4: board, bottom side, seen from below]

Outline 50 x 30 mm; copper layers: Top Layer, Bottom Layer. Coordinates in mm from the lower left corner of the outline.
Outline path: rectangle 0,30 50,0
Stack: Top Layer 0.035mm / Dielectric1 1.51mm FR4 er 4.5 / Bottom Layer 0.035mm

## Design rules (mm)
template: Custom Config
spacing copperThickness1oz (default): track to track 0.102, other pairs 0.152 to 0.3
spacing copperThickness2oz: track to track 0.203, other pairs 0.152 to 0.3
track width copperThickness1oz (default): min 0.127, default 0.254, max 2.54
track width copperThickness2oz: min 0.203, default 0.254, max 2.54
differential pair differentialPair (default): width min 0.127, default 0.254, max 2.54; gap min 0.152, default 0.152
via viaSize (default): diameter min 0.5, default 0.61, max 10; hole min 0.3, default 0.305, max 6.3
net VCC uses copperRegion1
net GND uses copperRegion1
net MOT1 uses copperRegion1
net MOT2 uses copperRegion1
pour e572 uses copperRegion1

## Placement (name value [footprint] x y rotation side)
C2  100nF  [CAP-TH_L5.0-W2.5-P5.08-D0.7]  29 22.5 270 top
C3  100nF  [CAP-TH_L5.0-W2.5-P5.08-D0.7]  29.5 8.5 270 top
C4  10uF  [C1206]  8.5 22 180 top
C7  10uF  [C1206]  8.5 25 180 top
C8  10uF  [C1206]  16.5 8.5 270 top
C9  10uF  [C1206]  16.5 22.5 270 top
D1  FR107W  [SOD-123F_L2.8-W1.8-LS3.7-RD]  19.5 22.5 270 top
D5  FR107W  [SOD-123F_L2.8-W1.8-LS3.7-RD]  35 17.5 0 top
D6  FR107W  [SOD-123F_L2.8-W1.8-LS3.7-RD]  35 24.5 0 top
D7  FR107W  [SOD-123F_L2.8-W1.8-LS3.7-RD]  19.5 8.5 270 top
D8  FR107W  [SOD-123F_L2.8-W1.8-LS3.7-RD]  35 3.5 0 top
D9  FR107W  [SOD-123F_L2.8-W1.8-LS3.7-RD]  35 10.5 0 top
H1  2.54-1x6P直针  [HDR-TH_6P-P2.54-V-M-1]  2 15.5 90 top
H2  PZ254V-11-02P  [HDR-TH_2P-P2.54-V-M]  48 15 270 top
LED1  NCD0805R1  [LED0805-R-RD]  18.5 28.5 0 top
LED2  NCD0805R1  [LED0805-R-RD]  13.5 28.5 180 top
LED3  NCD0805R1  [LED0805-R-RD]  8.75 5.25 90 top
LED4  NCD0805R1  [LED0805-R-RD]  6 5.25 90 top
LED5  NCD0805R1  [LED0805-R-RD]  11.5 5.25 90 top
Q1  NTMFS4937NT1G  [DFN-5_L6.1-W5.1-P1.27-BL]  42 26 90 top
Q2  NTMFS4937NT1G  [DFN-5_L6.1-W5.1-P1.27-BL]  42 19 90 top
Q3  NTMFS4937NT1G  [DFN-5_L6.1-W5.1-P1.27-BL]  42 12 90 top
Q4  NTMFS4937NT1G  [DFN-5_L6.1-W5.1-P1.27-BL]  42 5 90 top
R1  10Ω  [R0805]  35 27.5 0 top
R2  10Ω  [R0805]  35 20.5 0 top
R3  10Ω  [R0805]  35 13.5 0 top
R4  10Ω  [R0805]  35 6.5 0 top
R5  1k  [R0603]  21.75 28.25 270 top
R6  2k  [R0603]  10.5 28.25 270 top
R7  1k  [R0603]  8.75 9.25 90 top
R8  1k  [R0603]  6 9.25 90 top
R9  1k  [R0603]  11.5 9.25 90 top
SCREW1  -  [Screw-Hole-M2]  2.85 2.57 0 top
SCREW2  -  [Screw-Hole-M2]  2.85 27.57 0 top
SCREW3  -  [Screw-Hole-M2]  47.82 2.57 0 top
SCREW4  -  [Screw-Hole-M2]  47.82 27.57 0 top
U1  IR2104SPBF  [SOIC-8_L4.9-W3.9-P1.27-LS6.0-BL]  24 22.5 0 top
U3  SN74HC00DR  [SOIC-14_L8.7-W3.9-P1.27-LS6.0-BL]  10.5 15.5 0 top
U4  IR2104SPBF  [SOIC-8_L4.9-W3.9-P1.27-LS6.0-BL]  24 8.5 0 top

## Footprints (pads in the part's own frame, mm; a bottom-side part is the same pattern mirrored in y, then rotated)
C1206
  rect 1.485x1.728 smd: 1(-1.593,0) 2(1.593,0)
CAP-TH_L5.0-W2.5-P5.08-D0.7
  round 1.4 hole 0.8: 1(-2.54,0) 2(2.54,0)
DFN-5_L6.1-W5.1-P1.27-BL
  rect 0.75x1 smd: 1(-1.905,-1.875) 2(-0.635,-1.875) 3(0.635,-1.875) 4(1.905,-1.875)
  custom 5.55x4.53 smd: 5(0,1.875)
HDR-TH_2P-P2.54-V-M
  rect 2x2 hole 1.2: 1(-1.27,0)
  round 2 hole 1.2: 2(1.27,0)
HDR-TH_6P-P2.54-V-M-1
  rect 1.8x1.8 hole 1.2: 1(-6.35,0)
  round 1.8 hole 1.2: 2(-3.81,0) 3(-1.27,0) 4(1.27,0) 5(3.81,0) 6(6.35,0)
LED0805-R-RD
  rect 1x1.399 smd: 1(1.05,0) 2(-1.05,0)
R0603
  rect 0.806x0.864 smd: 1(-0.753,0) 2(0.753,0)
R0805
  rect 1.133x1.377 smd: 1(-1,0) 2(1,0)
Screw-Hole-M2
  round 2 hole 2: 1(0,0)
SOD-123F_L2.8-W1.8-LS3.7-RD
  rect 1x1.2 smd: 1(-1.55,0) 2(1.55,0)
SOIC-8_L4.9-W3.9-P1.27-LS6.0-BL
  oval 0.588x2.045 smd: 1(-1.905,-2.772) 2(-0.635,-2.772) 3(0.635,-2.772) 4(1.905,-2.772) 5(1.905,2.772) 6(0.635,2.772) 7(-0.635,2.772) 8(-1.905,2.772)
SOIC-14_L8.7-W3.9-P1.27-LS6.0-BL
  oval 0.574x2.038 smd: 1(-3.81,-2.769) 2(-2.54,-2.769) 3(-1.27,-2.769) 4(0,-2.769) 5(1.27,-2.769) 6(2.54,-2.769) 7(3.81,-2.769) 8(3.81,2.769) 9(2.54,2.769) 10(1.27,2.769) 11(0,2.769) 12(-1.27,2.769) 13(-2.54,2.769) 14(-3.81,2.769)

## Nets
As in the schematic.

Pads without a net: SCREW1 1; SCREW2 1; SCREW3 1; SCREW4 1; U3 8 9 10

## Via types
v1: diameter 0.61, hole 0.305, Top Layer to Bottom Layer, 180 vias

## Routing (per net, layer and track width the routed paths; a pad name or vN(x,y) marks a point on that pad's centre or on a via; arc(x,y) is an arc through that point)
+3.3V: length 28.9
  Top Layer w0.25: C4.2 8,22 8.25,22.25 8.25,25.75 9,26.5 20,26.5 21,27.5 21.75,27.5
  Top Layer w0.4: C4.2 6.69,21.78 U3.14 6.69,17.19 6.27,16.77 H1.4
GND:
  vias: v1(1.5,7) v1(1.5,6.25) v1(1.5,5.25) v1(3,7) v1(3,6.25) v1(3,5.25) v1(6,29) v1(6,28) v1(7.5,29) v1(7.5,28) v1(12,24) v1(12,22.5) v1(12,21) v1(13.5,25.5) v1(13.5,24) v1(13.5,22.5) v1(13.5,21) v1(13.5,7) v1(13.5,4) v1(13.5,2.5) v1(13.5,1) v1(14.5,16) v1(15,25.5) v1(15,24) v1(15,22.5) v1(15,5.5) v1(15,4) v1(15,2.5) v1(15,1) v1(16,29.25) v1(16,16) v1(16,14.5) v1(16,13) v1(16,11.5) v1(16.5,25.5) v1(16.5,22.5) v1(16.46,4) v1(16.75,5.5) v1(17.5,19) v1(17.5,16) v1(17.5,14.5) v1(17.5,13) v1(17.5,11.49) v1(18,25.5) v1(18,22.5) v1(18,5.5) v1(18,4) v1(19,19) v1(19,16) v1(19,14.5) v1(19,13) v1(19,11.5) v1(19.5,25.5) v1(19.51,22.5) v1(19.5,4) v1(20.5,19) v1(20.5,16) v1(20.5,14.5) v1(20.5,13) v1(20.5,11.5) v1(20.5,5.5) v1(21.07,4) v1(22.5,4) v1(23.5,17.5) v1(23.5,16) v1(24,29) v1(24.01,4) v1(25.5,29) v1(25.5,4) v1(26,19) v1(26.5,17.5) v1(26.5,16) v1(27,29) v1(27,7) v1(27,5.5) v1(27,4) v1(28,19) v1(28,17.5) v1(28,16) v1(28,11.5) v1(28.5,29) v1(28.5,4) v1(29.5,17.5) v1(29.5,16) v1(30,29) v1(30,2.5) v1(30,1) v1(30.25,4) v1(31,19) v1(31,17.5) v1(31,16) v1(31,13) v1(31,11.5) v1(31.5,29) v1(31.5,12.25) v1(31.5,5.5) v1(31.5,4) v1(31.5,2.5) v1(31.5,1) v1(32.5,19) v1(32.5,16) v1(32.5,11.5) v1(33,29) v1(33,1) v1(34.5,29) v1(34.5,1) v1(36,8.5) v1(36,1) v1(37.5,1) v1(39,1) v1(40.5,1) v1(42,1) v1(43.5,1) v1(43.75,15.75) v1(44.5,15.75) v1(44.75,15) v1(45,29) v1(45,28) v1(45,20.25) v1(45,19.5) v1(45,5.5) v1(45,4) v1(45,2.5) v1(45,1) v1(45.5,14.5) v1(45.5,13.77) v1(45.75,19.75) v1(45.75,19) v1(45.75,15.25) v1(46.5,26.5) v1(46.5,25) v1(46.5,23.5) v1(46.5,7) v1(46.5,5.5) v1(48,25) v1(48,23.5) v1(48,22) v1(48,7) v1(48,5.43)
VCC: length 82.8
  Top Layer w0.25: R6.2 8.5,27.5 6.91,25.91 v1(6.91,25)
  Top Layer w0.4: v1(22.09,5.73) 20.87,6.95 D7.2 19.46,6.91 C8.2 ; v1(22.09,19.73) 20.87,20.95 D1.2 19.46,20.91 C9.2
  Bottom Layer w0.5: 9.5,24.5 9,25 v1(6.91,25) ; v1(22.09,5.73) v1(22.09,19.73) 22.09,26.36 20.95,27.5
  Bottom Layer w2: H1.5 3.9,19.31 12.09,27.5 v1(39,27.5)
  vias: v1(39,25.99) v1(39,24.5) v1(39,13.5) v1(39,11.99) v1(39,10.5) v1(40,27.5) v1(40,26) v1(40,24.5) v1(40,13.5) v1(40,12) v1(40,10.5) v1(41,27.5) v1(41,24.5) v1(41,13.5) v1(40.99,11.99) v1(41,10.5) v1(41.18,25.99)
MOT1: length 26.4
  Top Layer w0.4: Q2.5 40.12,18.88 37.5,16.25 35.5,16.25 35,16.75 35,21.65 34.65,22 32.04,22 C2.1 29,26.6 28.6,27 25.03,27 24.63,26.6 U1.6
  vias: v1(39,20.5) v1(39,19) v1(39,17.5) v1(40,20.5) v1(40,19) v1(40,17.5) v1(41,20.5) v1(41,19) v1(41,17.5)
MOT2: length 25.8
  Top Layer w0.4: Q4.5 40.12,4.88 37.25,2 36,2 35,3 35,7.5 34.5,8 32.54,8 C3.1 29.5,12 28.5,13 25.39,13 24.63,12.25 U4.6
  vias: v1(39,6.5) v1(39,5) v1(39,3.5) v1(40,6.5) v1(40,5) v1(40,3.5) v1(41,6.5) v1(41,5) v1(41,3.5)
OUT1: length 25.1
  Top Layer w0.4: U1.2 23.37,18.61 22.75,18 16.75,18 14.75,20 8.46,20 7.96,19.5 v1(7.96,18.27)
  Bottom Layer w0.4: v1(9.23,12.73) 9.23,17 v1(7.96,18.27)
OUT2: length 24
  Top Layer w0.4: U4.2 23.37,6.95 22.06,8.25 13.75,8.25 13,9 13,12.69 U3.6 13.04,13.71 12.25,14.5 11,14.5 9.23,16.27 U3.12
PWM: length 17.7
  Top Layer w0.25: U3.5 11.77,11.52 11.5,11.25 R9.2 10.75,10 10,9.25 10,9.25 4.02,9.25 4,9.27 4,10.65 6.08,12.73 U3.1
  Top Layer w0.4: H1.1 2.1,9.25 4.02,9.25
SELECT: length 34.9
  Top Layer w0.4: 18.25,14.75 18.25,9.5 18.75,9 22.09,9 24.63,6.46 U4.3 ; 18.25,14.75 18.75,15.25 24,15.25 24.63,15.89 U1.3 ; 18.25,14.75 17.75,15.25 11.25,15.25 10.5,16 U3.11
SLC-M1: length 13.5
  Top Layer w0.25: R8.2 6,10.77 6.23,11 7.5,11 7.96,11.46 U3.2
  Top Layer w0.4: H1.2 4.19,11.69 4.75,12.25 4.75,13.25 6,14.5 7.46,14.5 7.96,14 U3.2
SLC-M2: length 14.6
  Top Layer w0.25: U3.4 10.5,11.25 10.25,11 9.25,11 8.75,10.5 R7.2
  Top Layer w0.4: U3.4 10.5,13.75 9,15.25 5.75,15.25 4.73,14.23 H1.3
$1N2563: length 12.6
  Top Layer w0.4: Q2.4 42.28,22.5 38,22.5 R2.2 36.55,19.95 D5.2
$1N2573: length 12.6
  Top Layer w0.4: Q1.4 42.28,29.5 38,29.5 R1.2 36.55,26.95 D6.2
$1N2580: length 12.9
  Top Layer w0.3: D1.1 20.87,24.05 U1.8
  Top Layer w0.4: U1.8 22.09,24.05 23.65,22.5 26,22.5 28.54,19.96 C2.2
$1N2605: length 13.3
  Top Layer w0.4: U1.5 30.68,20.5 R2.1 34,18.05 D5.1
$1N2712: length 16.1
  Top Layer w0.4: D6.1 34,25.05 R1.1 33.5,28 24.5,28 23.37,26.86 U1.7
$1N3149: length 12.6
  Top Layer w0.4: D8.2 36.55,5.95 R4.2 38,8.5 42.28,8.5 Q4.4
$1N3153: length 12.6
  Top Layer w0.4: D9.2 36.55,12.95 R3.2 38,15.5 42.28,15.5 Q3.4
$1N3157: length 13.5
  Top Layer w0.3: U4.8 20.87,10.05 D7.1
  Top Layer w0.4: U4.8 22.09,9.91 23.5,8.5 26.96,8.5 C3.2
$1N3161: length 13.3
  Top Layer w0.4: U4.5 30.68,6.5 R4.1 34,4.05 D8.1
$1N3174: length 16.1
  Top Layer w0.4: D9.1 34,11.05 R3.1 33.5,14 24.5,14 23.37,12.86 U4.7
$1N6041: length 2.4
  Top Layer w0.25: LED1.1 20.5,28.5 21,29 R5.1
$1N6069: length 2.2
  Top Layer w0.25: R6.1 10.5,29 11.5,29 12,28.5 LED2.1
$1N6194: length 2.2
  Top Layer w0.25: R7.1 LED3.1
$1N6279: length 2.2
  Top Layer w0.25: R8.1 LED4.1
$1N6364: length 2.2
  Top Layer w0.25: R9.1 LED5.1

## Copper pours and planes (outline as drawn; the poured copper is in the pictures)
GND on Top Layer: -0.5,32.25 -0.5,-4 54.75,-4 54.75,32.75 0,32.75
GND on Bottom Layer: -1.5,31.25 -1.5,-2 63.5,-2 63.5,31.25
VCC on Bottom Layer: 42,9.5 42,14.5 37.5,14.5 37.5,23 42.5,23 42.5,28.5 35.5,28.5 34.5,27.5 34.5,10.5 35.5,9.5
MOT1 on Top Layer: 49.5,15.5 46.5,15.5 46.5,20 43.5,23 43.5,27 45.5,27 45.5,23.5 49.5,19.5
MOT1 on Bottom Layer: 38,21 42.5,21 45,18.5 46.73,17.54 49.27,17.54 49.27,15.5 47,15.5 46,16.5 38.1,16.5 38,16.6
MOT2 on Top Layer: 49,14.5 46.5,14.5 46.5,13.5 46,13 43.5,13 43.5,9.5 45,9.5 48,12.5 49,12.5
MOT2 on Bottom Layer: 38,7.5 38,2 42,2 42,4.24 49.01,11.25 49.01,14.5 46.5,14.5 46.5,11.75 42.25,7.5

## Text on the board
Bottom Silkscreen Layer: GND | JLCJLCJLCJLC
Top Silkscreen Layer: JLCJLCJLCJLC | H-Bridge Motor Driver / V1.0 | S1 | S2 | PWM | PWR | 3v3

# Board PCB3
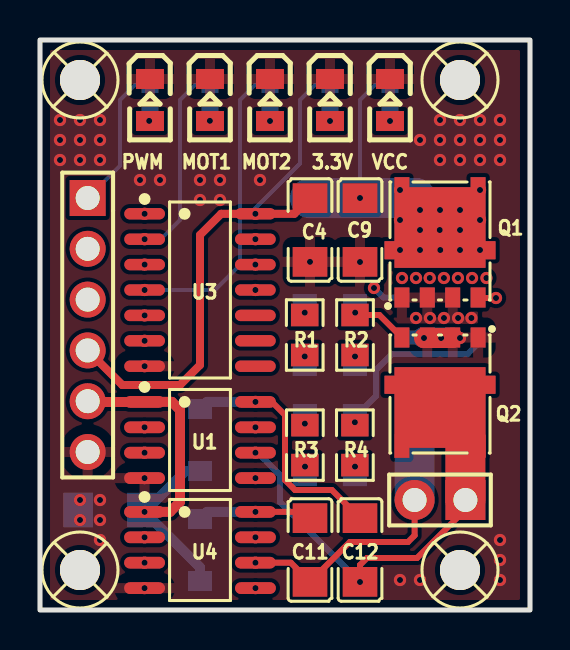
[diagram p5: board, top side]
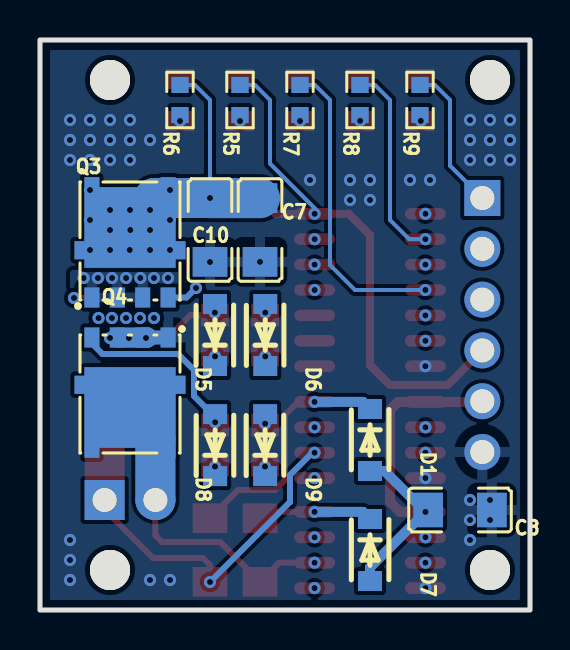
[diagram p6: board, bottom side, seen from below]

Outline 24.5 x 28.5 mm; copper layers: Top Layer, Inner1, Inner2, Bottom Layer. Coordinates in mm from the lower left corner of the outline.
Outline path: rectangle 0,28.5 24.5,0
Stack: Top Layer 0.035mm 外层铜厚1oz / Dielectric1 0.2104mm 7628 RC49% 8.6mil / Inner1 0.0152mm 内层铜厚 / Dielectric2 1.065mm 1.1mm H/HOZ 含铜 / Inner2 0.0152mm 内层铜厚 / Dielectric3 0.2104mm 7628 RC49% 8.6mil / Bottom Layer 0.035mm 外层铜厚1oz

## Design rules (mm)
template: Custom Config
spacing copperThickness1oz (default): track to track 0.102, other pairs 0.152 to 0.3
spacing copperThickness2oz: track to track 0.203, other pairs 0.152 to 0.3
track width copperThickness1oz (default): min 0.127, default 0.254, max 2.54
track width copperThickness2oz: min 0.203, default 0.254, max 2.54
differential pair differentialPair (default): width min 0.127, default 0.254, max 2.54; gap min 0.152, default 0.152
via viaSize (default): diameter min 0.5, default 0.61, max 10; hole min 0.3, default 0.305, max 6.3
net VCC uses copperRegion1
net GND uses copperRegion1
net MOT1 uses copperRegion1
net MOT2 uses copperRegion1
pour e825 uses copperRegion1

## Placement (name value [footprint] x y rotation side)
3.3V  NCD0805R1  [LED0805-R-RD]  14.5 25.5 270 top
C4  10uF  [C1206]  13.5 19 90 top
C7  10uF  [C1206]  13.5 19 90 bottom
C8  10uF  [C1206]  3.5 5 0 bottom
C9  10uF  [C1206]  16 19 90 top
C10  10uF  [C1206]  16 19 90 bottom
C11  10uF  [C1206]  13.5 3 90 top
C12  10uF  [C1206]  16 3 90 top
D1  FR107W  [SOD-123F_L2.8-W1.8-LS3.7-RD]  8 8.5 270 bottom
D5  FR107W  [SOD-123F_L2.8-W1.8-LS3.7-RD]  15.75 13.75 90 bottom
D6  FR107W  [SOD-123F_L2.8-W1.8-LS3.7-RD]  13.24 13.75 90 bottom
D7  FR107W  [SOD-123F_L2.8-W1.8-LS3.7-RD]  8 3 270 bottom
D8  FR107W  [SOD-123F_L2.8-W1.8-LS3.7-RD]  15.74 8.24 90 bottom
D9  FR107W  [SOD-123F_L2.8-W1.8-LS3.7-RD]  13.24 8.24 90 bottom
H1  2.54-1x6P直针  [HDR-TH_6P-P2.54-V-M-1]  2.38 14.25 270 top
H2  PZ254V-11-02P  [HDR-TH_2P-P2.54-V-M]  20 5.5 180 top
MOT1  NCD0805R1  [LED0805-R-RD]  8.5 25.5 270 top
MOT2  NCD0805R1  [LED0805-R-RD]  11.5 25.5 270 top
PWM  NCD0805R1  [LED0805-R-RD]  5.5 25.5 270 top
Q1  NTMFS4937NT1G  [DFN-5_L6.1-W5.1-P1.27-BL]  20 17.5 0 top
Q2  NTMFS4937NT1G  [DFN-5_L6.1-W5.1-P1.27-BL]  20 11.75 180 top
Q3  NTMFS4937NT1G  [DFN-5_L6.1-W5.1-P1.27-BL]  20 17.5 180 bottom
Q4  NTMFS4937NT1G  [DFN-5_L6.1-W5.1-P1.27-BL]  20 11.75 0 bottom
R1  10Ω  [R0805]  13.24 13.75 90 top
R2  10Ω  [R0805]  15.75 13.75 90 top
R3  10Ω  [R0805]  13.24 8.24 90 top
R4  10Ω  [R0805]  15.74 8.24 90 top
R5  1k  [R0603]  14.5 25.5 90 bottom
R6  2k  [R0603]  17.5 25.5 90 bottom
R7  1k  [R0603]  11.5 25.5 90 bottom
R8  1k  [R0603]  8.5 25.5 90 bottom
R9  1k  [R0603]  5.5 25.5 90 bottom
SCREW1  -  [Screw-Hole-M2]  2 2 0 top
SCREW2  -  [Screw-Hole-M2]  21 26.5 0 top
SCREW3  -  [Screw-Hole-M2]  2 26.5 0 top
SCREW4  -  [Screw-Hole-M2]  21 2 0 top
U1  IR2104SPBF  [SOIC-8_L4.9-W3.9-P1.27-LS6.0-BL]  8 8.5 270 top
U3  SN74HC00DR  [SOIC-14_L8.7-W3.9-P1.27-LS6.0-BL]  8 16 270 top
U4  IR2104SPBF  [SOIC-8_L4.9-W3.9-P1.27-LS6.0-BL]  8 3 270 top
VCC  NCD0805R1  [LED0805-R-RD]  17.5 25.5 270 top

## Footprints (pads in the part's own frame, mm; a bottom-side part is the same pattern mirrored in y, then rotated)
C1206
  rect 1.485x1.728 smd: 1(-1.593,0) 2(1.593,0)
DFN-5_L6.1-W5.1-P1.27-BL
  rect 0.75x1 smd: 1(-1.905,-1.875) 2(-0.635,-1.875) 3(0.635,-1.875) 4(1.905,-1.875)
  custom 5.55x4.53 smd: 5(0,1.875)
HDR-TH_2P-P2.54-V-M
  rect 2x2 hole 1.2: 1(-1.27,0)
  round 2 hole 1.2: 2(1.27,0)
HDR-TH_6P-P2.54-V-M-1
  rect 1.8x1.8 hole 1.2: 1(-6.35,0)
  round 1.8 hole 1.2: 2(-3.81,0) 3(-1.27,0) 4(1.27,0) 5(3.81,0) 6(6.35,0)
LED0805-R-RD
  rect 1x1.399 smd: 1(1.05,0) 2(-1.05,0)
R0603
  rect 0.806x0.864 smd: 1(-0.753,0) 2(0.753,0)
R0805
  rect 1.133x1.377 smd: 1(-1,0) 2(1,0)
Screw-Hole-M2
  round 2 hole 2: 1(0,0)
SOD-123F_L2.8-W1.8-LS3.7-RD
  rect 1x1.2 smd: 1(-1.55,0) 2(1.55,0)
SOIC-8_L4.9-W3.9-P1.27-LS6.0-BL
  oval 0.588x2.045 smd: 1(-1.905,-2.772) 2(-0.635,-2.772) 3(0.635,-2.772) 4(1.905,-2.772) 5(1.905,2.772) 6(0.635,2.772) 7(-0.635,2.772) 8(-1.905,2.772)
SOIC-14_L8.7-W3.9-P1.27-LS6.0-BL
  oval 0.574x2.038 smd: 1(-3.81,-2.769) 2(-2.54,-2.769) 3(-1.27,-2.769) 4(0,-2.769) 5(1.27,-2.769) 6(2.54,-2.769) 7(3.81,-2.769) 8(3.81,2.769) 9(2.54,2.769) 10(1.27,2.769) 11(0,2.769) 12(-1.27,2.769) 13(-2.54,2.769) 14(-3.81,2.769)

## Nets
As in the schematic.

Pads without a net: SCREW1 1; SCREW2 1; SCREW3 1; SCREW4 1; U3 8 9 10

## Via types
v1: diameter 0.61, hole 0.305, Top Layer to Bottom Layer, 114 vias

## Routing (per net, layer and track width the routed paths; a pad name or vN(x,y) marks a point on that pad's centre or on a via; arc(x,y) is an arc through that point)
+3.3V: length 27.9
  Top Layer w0.4: C4.2 12.72,19.81 v1(10.77,19.81) 9.06,19.81 8,18.75 8,12.25 7,11.25 4.11,11.25 H1.4
  Bottom Layer w0.2: R5.2 13.75,26.25 13,25.5 13,22.32 10.77,20.09 v1(10.77,19.81)
GND: length 4
  Top Layer w1: v1(19.2,13.6) v1(20.06,13.6) 20.61,13.6 Q2.2
  Bottom Layer w0.7: Q4.1 19.12,13.62
  Bottom Layer w1: v1(19.2,13.6) 19.18,13.62 ; 19.18,13.62 19.12,13.62 ; 19.18,13.62 Q2.3 Q2.2
  vias: v1(1,24.5) v1(1,23.5) v1(1,22.5) v1(2,24.5) v1(2,23.5) v1(2,22.5) v1(2,5.5) v1(2,4.5) v1(3,24.5) v1(3,23.5) v1(3,22.5) v1(3,5.5) v1(3,4.5) v1(3,3.5) v1(5,21.5) v1(5.23,12.19) v1(5.23,6.59) v1(5.23,1.09) v1(6,21.5) v1(8,21.5) v1(8,20.5) v1(9,21.5) v1(9,20.5) v1(11,21.5) v1(13.5,17.41) v1(16,17.4) v1(18,1.5) v1(19,23.5) v1(19,1.5) v1(20,24.5) v1(20,23.5) v1(20,22.5) v1(21,24.5) v1(21,23.5) v1(21,22.5) v1(21,13.6) v1(22,24.5) v1(22,23.5) v1(22,22.5) v1(23,24.5) v1(23,23.5) v1(23,22.5) v1(23,3.5) v1(23,2.5) v1(23,1.5)
VCC: length 33.3
  Top Layer w0.5: v1(5.23,4.91) 6.5,4.91 7,5.41 7,10 6.59,10.41 U1.1 5.22,10.4 2.42,10.4 H1.5
  Bottom Layer w0.2: R6.2 16.75,26.25 16,25.5 C9.2
  Bottom Layer w0.5: D7.2 8,2.13 v1(5.23,4.91) 7.27,6.95 D1.2
  Bottom Layer w2: Q1.5 18.78,20.6 v1(16,20.6) ; C7.2 C9.2
  vias: v1(18,21) v1(18,19.5) v1(18,18) v1(19,20) v1(19,19) v1(19,18) v1(20,20) v1(19.99,19) v1(20.01,18) v1(21,20) v1(21,19) v1(21,18) v1(22,21) v1(22,19.5) v1(22,18)
MOT1: length 21.3
  Top Layer w0.3: H2.1 21.27,5.02 18.85,2.6 16.35,2.6 16,2.25 C12.1
  Top Layer w2: H2.1 21.27,8.61 Q2.5
  Bottom Layer w0.3: v1(10.77,7.86) 10.88,7.86 12,6.75 12,5.4 v1(16,1.4)
  vias: v1(18.8,14.6) v1(19.5,14.6) v1(20.2,14.6) v1(20.9,14.6) v1(21.57,14.6)
MOT2: length 16
  Top Layer w0.3: v1(10.77,2.36) 12.54,2.36 C11.1 15.49,3.4 18.4,3.4 18.73,3.73 H2.2
  Bottom Layer w2: Q4.5 18.73,8.61 H2.2
  vias: v1(18.1,16.6) v1(18.8,16.6) v1(19.49,16.6) v1(20.2,16.6) v1(20.9,16.6) v1(21.6,16.6) v1(22.32,16.6)
OUT1: length 14.8
  Inner1 w0.3: v1(10.77,18.54) 10.73,18.5 8.5,18.5 7.27,17.27 v1(5.23,17.27) ; v1(5.23,9.14) 6,9.91 6,16.5 5.23,17.27
OUT2: length 19.3
  Inner1 w0.3: v1(5.23,3.64) 4.5,4.36 4.5,13 4.96,13.46 v1(5.23,13.46)
  Inner2 w0.3: v1(10.77,17.27) 8.5,17.27 8,16.77 8,14 7.46,13.46 v1(5.23,13.46)
PWM: length 16.5
  Inner1 w0.3: 3.17,19.81 4,18.98 4,15.96 v1(5.23,14.73) ; 3.17,19.81 2.38,20.6 ; 3.17,19.81 v1(5.23,19.81)
  Bottom Layer w0.2: 2.38,20.6 4,22.22 4,25.5 4.75,26.25 R9.2
SELECT: length 18.2
  Inner1 w0.3: v1(10.77,16) 8,16 6.5,14.5 6.5,9.14 v1(5.23,7.86) 5.23,7.77 6,7 6,3.14 v1(5.23,2.36)
SLC-M1: length 13
  Inner2 w0.3: v1(5.23,18.54) 2.87,18.54 H1.2
  Bottom Layer w0.2: v1(5.23,18.54) 6.04,18.54 7,19.5 7,25.5 7.75,26.25 R8.2
SLC-M2: length 18.4
  Inner2 w0.3: v1(5.23,16) 2.87,16 2.38,15.52
  Bottom Layer w0.2: v1(5.23,16) 8.75,16 10,17.25 10,25.5 10.75,26.25 R7.2
$1N961: length 2.8
  Top Layer w0.3: Q2.4 16.97,14.75 R2.2
  vias: v1(15.76,14.87)
$1N962: length 11.8
  Top Layer w0.3: v1(22.8,15.6) 21.93,15.6 Q1.4
  Inner1 w0.3: v1(22.8,15.6) 18.1,15.6 16.8,16.9 16.4,16.9 14.37,14.87 v1(13.24,14.87)
$1N963: length 12.5
  Top Layer w0.3: v1(10.77,10.41) 11.59,10.41 12.25,9.75 12.25,6.5 12.75,6 14.59,6 C12.2
  Bottom Layer w0.5: D1.1 8.35,10.41 v1(10.77,10.41)
$1N964: length 8.3
  Inner1 w0.3: v1(15.75,12.68) 15.43,12.68 12.25,9.5 12.25,8.07 v1(10.77,6.59)
$1N966: length 4.6
  Inner1 w0.3: v1(13.24,12.68) 13.24,11.6 v1(10.77,9.14)
$1N973: length 8.7
  Bottom Layer w0.3: 15.74,9.79 15.89,9.79 16.8,10.7 16.8,12 17.6,12.8 21.38,12.8 21.91,13.33 Q4.4
  vias: v1(15.74,9.39)
$1N974: length 9.8
  Inner1 w0.3: v1(13.24,9.32) 13.32,9.32 16.4,12.4 16.4,15.8 v1(16.7,16.1)
  Bottom Layer w0.3: Q3.4 17.18,15.62 v1(16.7,16.1)
$1N975: length 5.8
  Top Layer w0.3: 13.5,4.6 13.19,4.91 v1(10.77,4.91)
  Bottom Layer w0.5: v1(10.77,4.91) 8.35,4.91 D7.1
$1N976: length 8.1
  Inner1 w0.3: v1(15.75,7.17) 15.75,6.07 v1(10.77,1.09)
$1N978: length 4.6
  Inner1 w0.3: v1(13.25,7.17) 13.25,6.11 v1(10.77,3.64)
$1N1617:
  vias: v1(14.5,24.45)
$1N1618:
  vias: v1(17.5,24.45)
$1N1619:
  vias: v1(11.5,24.45)
$1N1622:
  vias: v1(8.49,24.46)
$1N1625:
  vias: v1(5.46,24.46)

## Copper pours and planes (outline as drawn; the poured copper is in the pictures)
GND on Top Layer: 0,28.5 24.5,28.5 24.5,0 0,0
GND on Bottom Layer: 0,28.5 24.5,28.5 24.5,0 0,0
GND on Inner1: 0,28.5 24.5,28.5 24.5,0 0,0
GND on Inner2: 0.2,28.4 24.7,28.4 24.7,-0.1 0.2,-0.1
VCC on Inner2: 0,11.5 10,21.5 23,21.5 23,17.5 17,17.5 9,9.5 0,9.5
MOT1 on Top Layer: 17.55,16.14 21.9,16.14 21.9,14.3 17.55,14.3 17.55,16.14
MOT1 on Inner1: 24.5,15 24.5,3.99 16.66,3.99 16.66,15
MOT2 on Bottom Layer: 17.6,17 22.9,17 23,16.9 23,15 17.7,15 17.6,14.9
MOT2 on Inner2: 24.5,17 16.16,17 16.16,4 24.5,4
